# Altium project B108AA.PrjPcb (part 1 of 4)
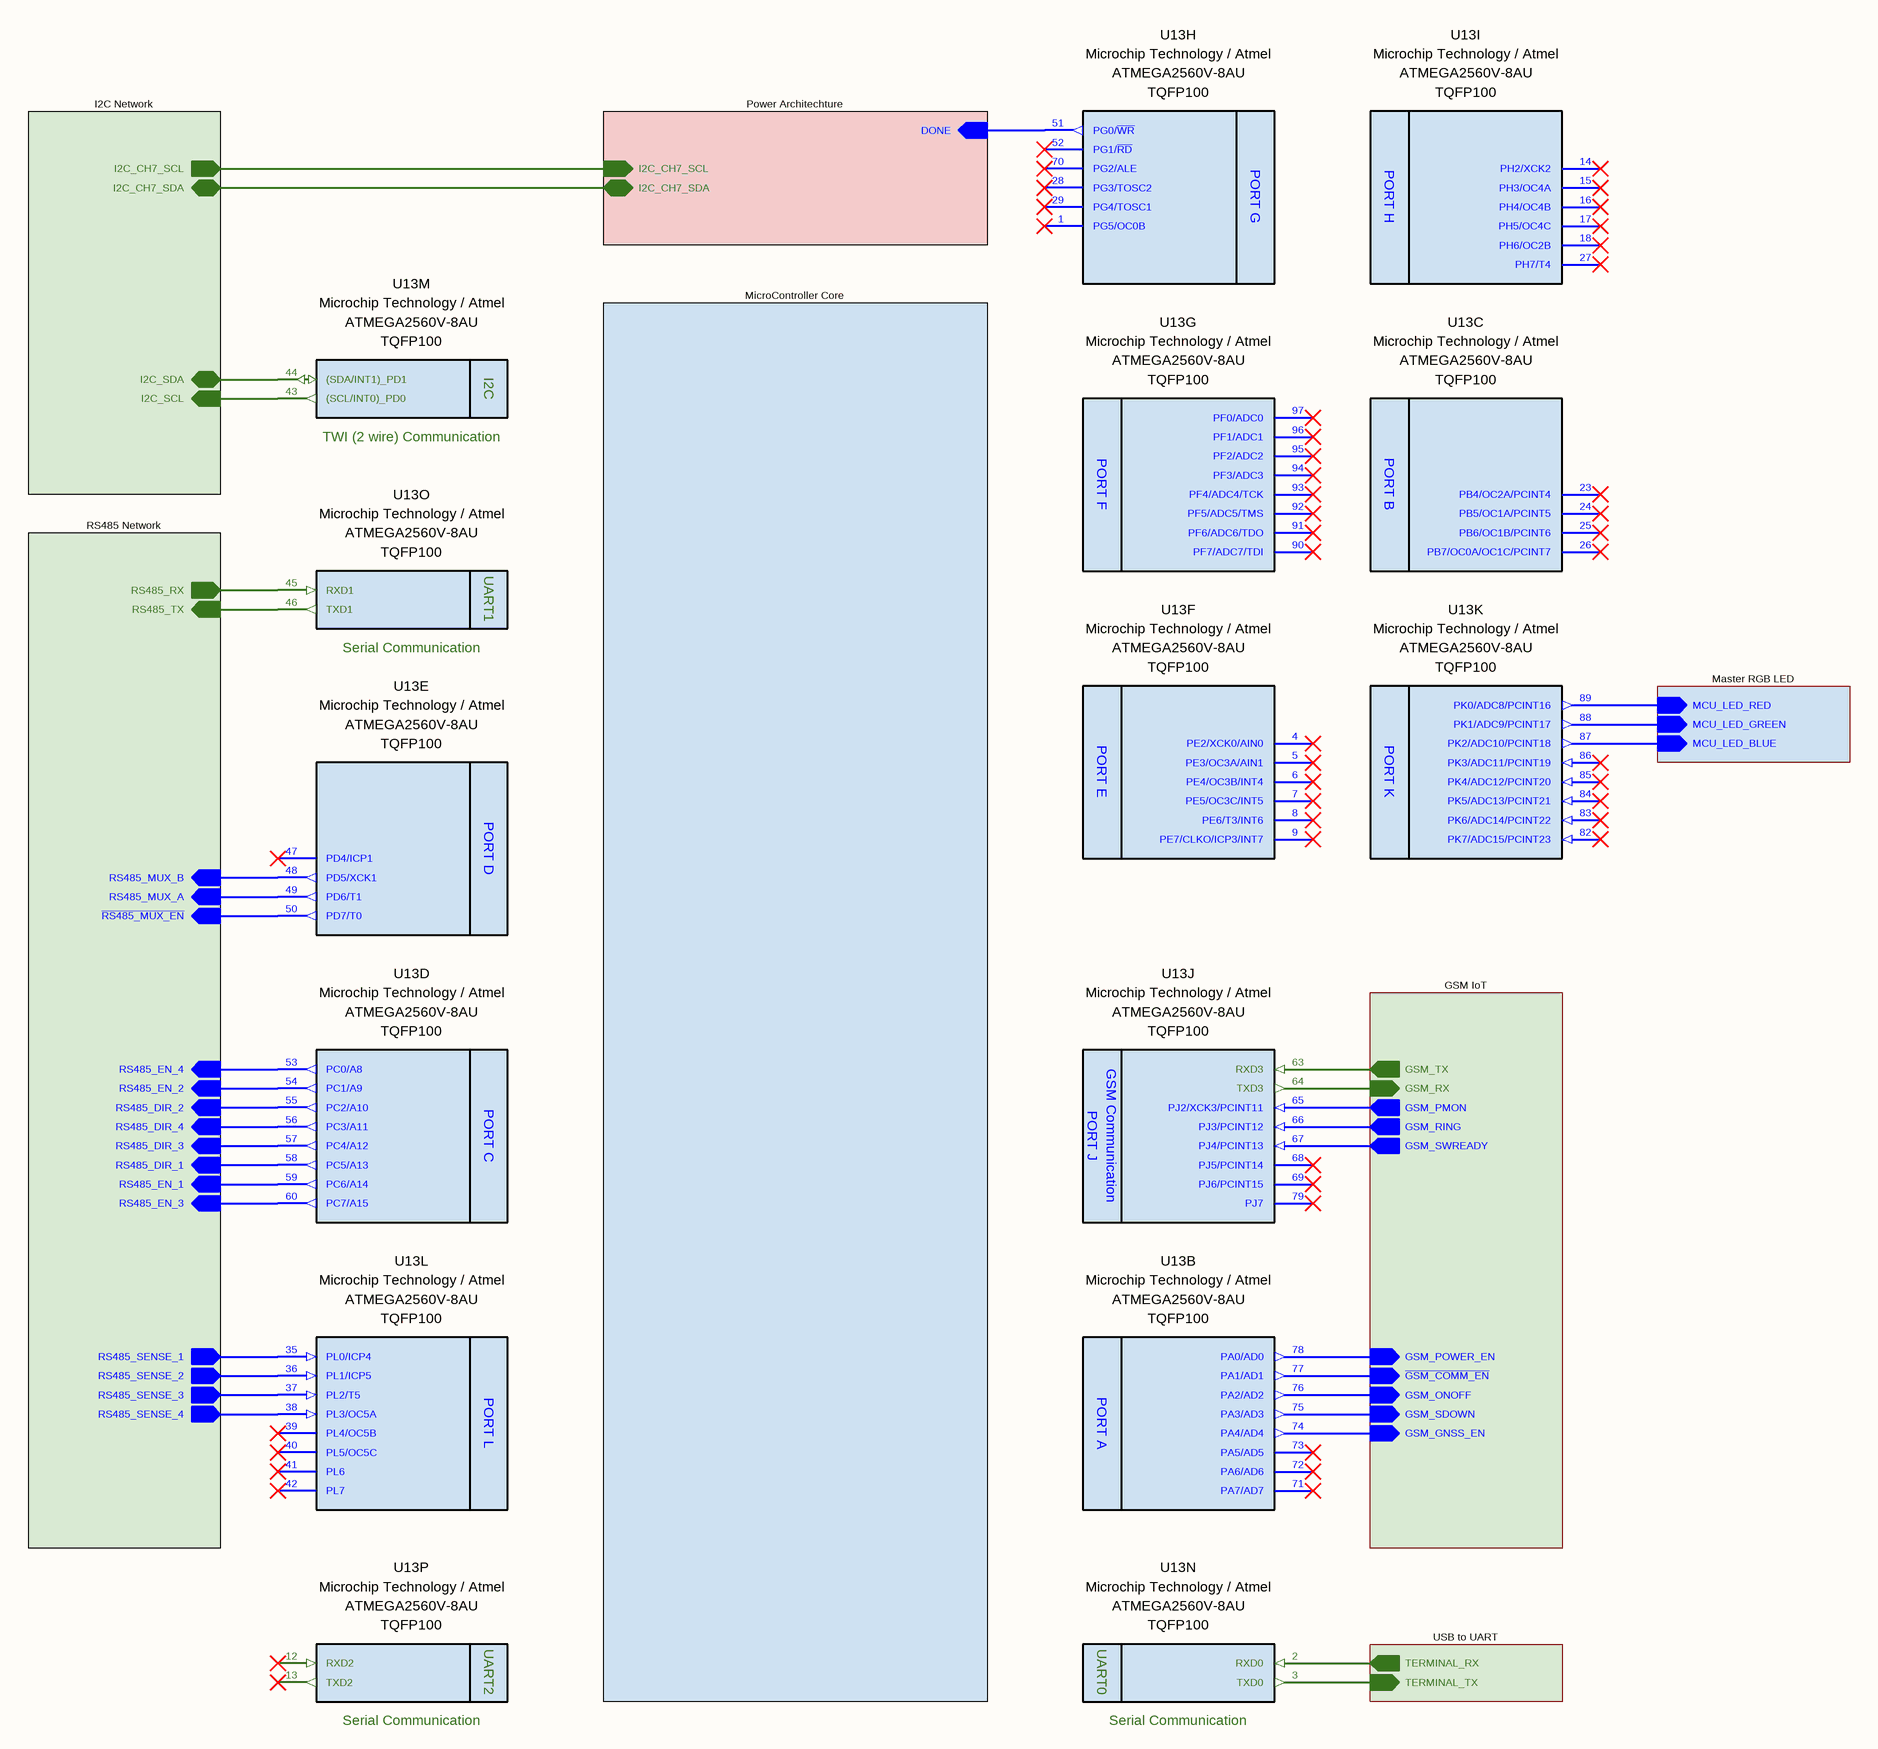
[diagram p0: Block Diagram.SchDoc]
Address1_: 4. O.S.B. Büyük Kayacık Mh.; Address2_: 103. Cd. No:12; Address3_: Selcuklu / Konya; Address4_: Türkiye; Copyright_: Copyright 2023 Mehmet Gunce Akkoyun (Commercial Secret); Customer_: STF Labs; Engineer_: Gunce Akkoyun; Git_Repo_Address_: www.github.com/akkoyun/B108AA; Module_ID_: B108AA; Organization_: STF Irrigation; Product_Desc_: WeatherStat V4; Product_ID_: -; Revision_: 01.00.00; Version_: R1
40 sheets, 315 parts. Net scope: hierarchical (ports join the sheet entries above them; power ports are global).
Board file: B108AA.PcbDoc
Sheets:
  Block Diagram.SchDoc
    RS485 Network = RS485 Outputs.SchDoc
      RS485 Channel 1 = RS485 Channel 1.SchDoc
      RS485 Channel 2 = RS485 Channel 2.SchDoc
      RS485 Channel 3 = RS485 Channel 3.SchDoc
      RS485 Channel 4 = RS485 Channel 4.SchDoc
      RS485 UART Multiplexer = RS485 UART Multiplexer.SchDoc
    I2C Network = I2C Network.SchDoc
      I2C Multiplexer = I2C Multiplexer.SchDoc
      I2C DP Sensor 1 = I2C DP Sensor 1.SchDoc
      I2C DP Sensor 2 = I2C DP Sensor 2.SchDoc
      I2C DP Sensor 3 = I2C DP Sensor 3.SchDoc
      I2C Air Pressure Sensor = I2C Air Pressure Sensor.SchDoc
      I2C TH Sensor = I2C TH Sensor Socket.SchDoc
      I2C UV Sensor = I2C UV Sensor.SchDoc
      I2C Serial ID = I2C Serial ID.SchDoc
    Power Architechture = Power Architechture.SchDoc
      Battery & Battery Measurement = Power Battery Measurement.SchDoc
      Battery Charger = Power Battery Charger.SchDoc
      5V Boost Converter = Power 5V Boost Converter.SchDoc
      3V3 LDO Regulator = Power 3V3 Regulator.SchDoc
      Sleep Timer = Power Sleep Timer.SchDoc
    GSM IoT = GSM IoT Block Diagram.SchDoc
      Signal Translator = GSM Voltage Translator.SchDoc
      GSM Antenna Match = GSM Modem Antenna.SchDoc
      Connection Status LED Driver = GSM Status LED Driver.SchDoc
      SIM Socket = GSM SIM Socket.SchDoc
      Power Source = GSM Power Source.SchDoc
      GSM UnUsed Pins = GSM UnUsed.SchDoc
      GNSS Antenna Match = GNSS Antenna.SchDoc
      GNSS PPS LED Driver = GSM PPS LED Driver.SchDoc
      Signal Control = GSM Signal Block Diagram.SchDoc
        On-Off Control = GSM On-Off Signal Control.SchDoc
        SDown Control = GSM Shut Down Signal Control.SchDoc
        GNSS Enable Control = GSM GNSS En Signal Control.SchDoc
      Power LED Driver = GSM Power LED Driver.SchDoc
      GSM USB Connection = GSM USB Port.SchDoc
    MicroController Core = MicroController Core.SchDoc
    USB to UART = MicroController USB to UART Converter.SchDoc
    Master RGB LED = MicroController RGB LED.SchDoc

## Sheet Block Diagram.SchDoc: Block Diagram
size 393 x 292 mm; SheetNumber: 1; SheetTotal: 40

### Parts
U13  Manufacturer Name: Microchip Technology / Atmel  Case: TQFP100  [TQFP-100]  (hidden comment: ATMEGA2560V-8AU)  (parts B,C,D,E,F,G,H,I,J,K,L,M,N,O,P of 18)

### Sub-sheets
GSM IoT = GSM IoT Block Diagram.SchDoc: GSM_ONOFF (in), GSM_SDOWN (in), GSM_GNSS_EN (in), GSM_PMON (out), GSM_SWREADY (out), GSM_RING (out), ~{GSM_COMM_EN} (in), GSM_TX (out), GSM_RX (in), GSM_POWER_EN (in)
I2C Network = I2C Network.SchDoc: I2C_CH7_SDA (bidir), I2C_CH7_SCL (out), I2C_SDA (bidir), I2C_SCL (in)
Master RGB LED = MicroController RGB LED.SchDoc: MCU_LED_RED (in), MCU_LED_GREEN (in), MCU_LED_BLUE (in)
MicroController Core = MicroController Core.SchDoc: no entries
Power Architechture = Power Architechture.SchDoc: DONE (in), I2C_CH7_SDA (bidir), I2C_CH7_SCL (in)
RS485 Network = RS485 Outputs.SchDoc: RS485_EN_1 (in), RS485_SENSE_1 (out), RS485_DIR_1 (in), RS485_EN_2 (in), RS485_SENSE_2 (out), RS485_DIR_2 (in), RS485_EN_3 (in), RS485_SENSE_3 (out), RS485_DIR_3 (in), RS485_EN_4 (in), RS485_SENSE_4 (out), RS485_DIR_4 (in), ~{RS485_MUX_EN} (in), RS485_MUX_A (in), RS485_MUX_B (in), RS485_TX (in), RS485_RX (out)
USB to UART = MicroController USB to UART Converter.SchDoc: TERMINAL_TX (in), TERMINAL_RX (out)

### Nets
DONE: U13.51(PG0/~{WR}) ; sheet Power Architechture/DONE
~{GSM_COMM_EN}: U13.77(PA1/AD1) ; sheet GSM IoT/~{GSM_COMM_EN}
GSM_GNSS_EN: U13.74(PA4/AD4) ; sheet GSM IoT/GSM_GNSS_EN
GSM_ONOFF: U13.76(PA2/AD2) ; sheet GSM IoT/GSM_ONOFF
GSM_PMON: U13.65(PJ2/XCK3/PCINT11) ; sheet GSM IoT/GSM_PMON
GSM_POWER_EN: U13.78(PA0/AD0) ; sheet GSM IoT/GSM_POWER_EN
GSM_RING: U13.66(PJ3/PCINT12) ; sheet GSM IoT/GSM_RING
GSM_RX: U13.64(TXD3) ; sheet GSM IoT/GSM_RX
GSM_SDOWN: U13.75(PA3/AD3) ; sheet GSM IoT/GSM_SDOWN
GSM_SWREADY: U13.67(PJ4/PCINT13) ; sheet GSM IoT/GSM_SWREADY
GSM_TX: U13.63(RXD3) ; sheet GSM IoT/GSM_TX
I2C_CH7_SCL: sheet I2C Network/I2C_CH7_SCL, sheet Power Architechture/I2C_CH7_SCL
I2C_CH7_SDA: sheet I2C Network/I2C_CH7_SDA, sheet Power Architechture/I2C_CH7_SDA
I2C_SCL: U13.43((SCL/INT0)_PD0) ; sheet I2C Network/I2C_SCL
I2C_SDA: U13.44((SDA/INT1)_PD1) ; sheet I2C Network/I2C_SDA
MCU_LED_BLUE: U13.87(PK2/ADC10/PCINT18) ; sheet Master RGB LED/MCU_LED_BLUE
MCU_LED_GREEN: U13.88(PK1/ADC9/PCINT17) ; sheet Master RGB LED/MCU_LED_GREEN
MCU_LED_RED: U13.89(PK0/ADC8/PCINT16) ; sheet Master RGB LED/MCU_LED_RED
~{RS485_MUX_EN}: U13.50(PD7/T0) ; sheet RS485 Network/~{RS485_MUX_EN}
RS485_DIR_1: U13.58(PC5/A13) ; sheet RS485 Network/RS485_DIR_1
RS485_DIR_2: U13.55(PC2/A10) ; sheet RS485 Network/RS485_DIR_2
RS485_DIR_3: U13.57(PC4/A12) ; sheet RS485 Network/RS485_DIR_3
RS485_DIR_4: U13.56(PC3/A11) ; sheet RS485 Network/RS485_DIR_4
RS485_EN_1: U13.59(PC6/A14) ; sheet RS485 Network/RS485_EN_1
RS485_EN_2: U13.54(PC1/A9) ; sheet RS485 Network/RS485_EN_2
RS485_EN_3: U13.60(PC7/A15) ; sheet RS485 Network/RS485_EN_3
RS485_EN_4: U13.53(PC0/A8) ; sheet RS485 Network/RS485_EN_4
RS485_MUX_A: U13.49(PD6/T1) ; sheet RS485 Network/RS485_MUX_A
RS485_MUX_B: U13.48(PD5/XCK1) ; sheet RS485 Network/RS485_MUX_B
RS485_RX: U13.45(RXD1) ; sheet RS485 Network/RS485_RX
RS485_SENSE_1: U13.35(PL0/ICP4) ; sheet RS485 Network/RS485_SENSE_1
RS485_SENSE_2: U13.36(PL1/ICP5) ; sheet RS485 Network/RS485_SENSE_2
RS485_SENSE_3: U13.37(PL2/T5) ; sheet RS485 Network/RS485_SENSE_3
RS485_SENSE_4: U13.38(PL3/OC5A) ; sheet RS485 Network/RS485_SENSE_4
RS485_TX: U13.46(TXD1) ; sheet RS485 Network/RS485_TX
NetU13_2: U13.2(RXD0) ; sheet USB to UART/TERMINAL_RX
NetU13_3: U13.3(TXD0) ; sheet USB to UART/TERMINAL_TX

Not connected (* = marked no-connect by the designer): U13 1(PG5/OC0B)* 4(PE2/XCK0/AIN0)* 5(PE3/OC3A/AIN1)* 6(PE4/OC3B/INT4)* 7(PE5/OC3C/INT5)* 8(PE6/T3/INT6)* 9(PE7/CLKO/ICP3/INT7)* 12(RXD2)* 13(TXD2)* 14(PH2/XCK2)* 15(PH3/OC4A)* 16(PH4/OC4B)* 17(PH5/OC4C)* 18(PH6/OC2B)* 23(PB4/OC2A/PCINT4)* 24(PB5/OC1A/PCINT5)* 25(PB6/OC1B/PCINT6)* 26(PB7/OC0A/OC1C/PCINT7)* 27(PH7/T4)* 28(PG3/TOSC2)* 29(PG4/TOSC1)* 39(PL4/OC5B)* 40(PL5/OC5C)* 41(PL6)* 42(PL7)* 47(PD4/ICP1)* 52(PG1/~{RD})* 68(PJ5/PCINT14)* 69(PJ6/PCINT15)* 70(PG2/ALE)* 71(PA7/AD7)* 72(PA6/AD6)* 73(PA5/AD5)* 79(PJ7)* 82(PK7/ADC15/PCINT23)* 83(PK6/ADC14/PCINT22)* 84(PK5/ADC13/PCINT21)* 85(PK4/ADC12/PCINT20)* 86(PK3/ADC11/PCINT19)* 90(PF7/ADC7/TDI)* 91(PF6/ADC6/TDO)* 92(PF5/ADC5/TMS)* 93(PF4/ADC4/TCK)* 94(PF3/ADC3)* 95(PF2/ADC2)* 96(PF1/ADC1)* 97(PF0/ADC0)*

### Notes on the sheet
- © 2022 All rights reserved.
  This document may not, in whole or in part, be copied, photocopied, reproduced, translated or converted to any electronic or machine readable from without prior written permission of Mehmet Günce Akkoyun.
  Engineer contact : akkoyun@me.com
- Property of
- Engineer :
- Date :
- Size :
- A3
- Time :
- Project :
- Page :
- /
- Customer :
- Product ID :
- Module ID :
- Version :
- File :
- Revision :
- (in symbol IC - AtMega2560V-8AU, part B) PORT A
- (in symbol IC - AtMega2560V-8AU, part C) PORT B
- (in symbol IC - AtMega2560V-8AU, part D) PORT C
- (in symbol IC - AtMega2560V-8AU, part E) PORT D
- (in symbol IC - AtMega2560V-8AU, part F) PORT E
- (in symbol IC - AtMega2560V-8AU, part G) PORT F
- (in symbol IC - AtMega2560V-8AU, part H) PORT G
- (in symbol IC - AtMega2560V-8AU, part I) PORT H
- (in symbol IC - AtMega2560V-8AU, part J) PORT J; GSM Communication
- (in symbol IC - AtMega2560V-8AU, part K) PORT K
- (in symbol IC - AtMega2560V-8AU, part L) PORT L
- (in symbol IC - AtMega2560V-8AU, part M) I2C; TWI (2 wire) Communication
- (in symbol IC - AtMega2560V-8AU, part N) UART0; Serial Communication
- (in symbol IC - AtMega2560V-8AU, part O) UART1; Serial Communication
- (in symbol IC - AtMega2560V-8AU, part P) UART2; Serial Communication

### Library data of the parts
U13 = IC - AtMega2560V-8AU: ATmega Series 256 KB Flash 8 KB SRAM 8 MHz 8-Bit Microcontroller - TQFP-100; Program Memory Size: 256 kB; Core: AVR; Operating Supply Voltage: 2.7 V to 5.5 V; Maximum Clock Frequency: 8 MHz; Maximum Operating Temperature: + 85 C; Product Type: MicroControllers; Minimum Operating Temperature: - 40 C; Manufacturer Part Number: ATMEGA2560V-8AU

## Sheet RS485 Outputs.SchDoc: RS485 Outputs
size 292 x 193 mm; SheetNumber: 17; SheetTotal: 38
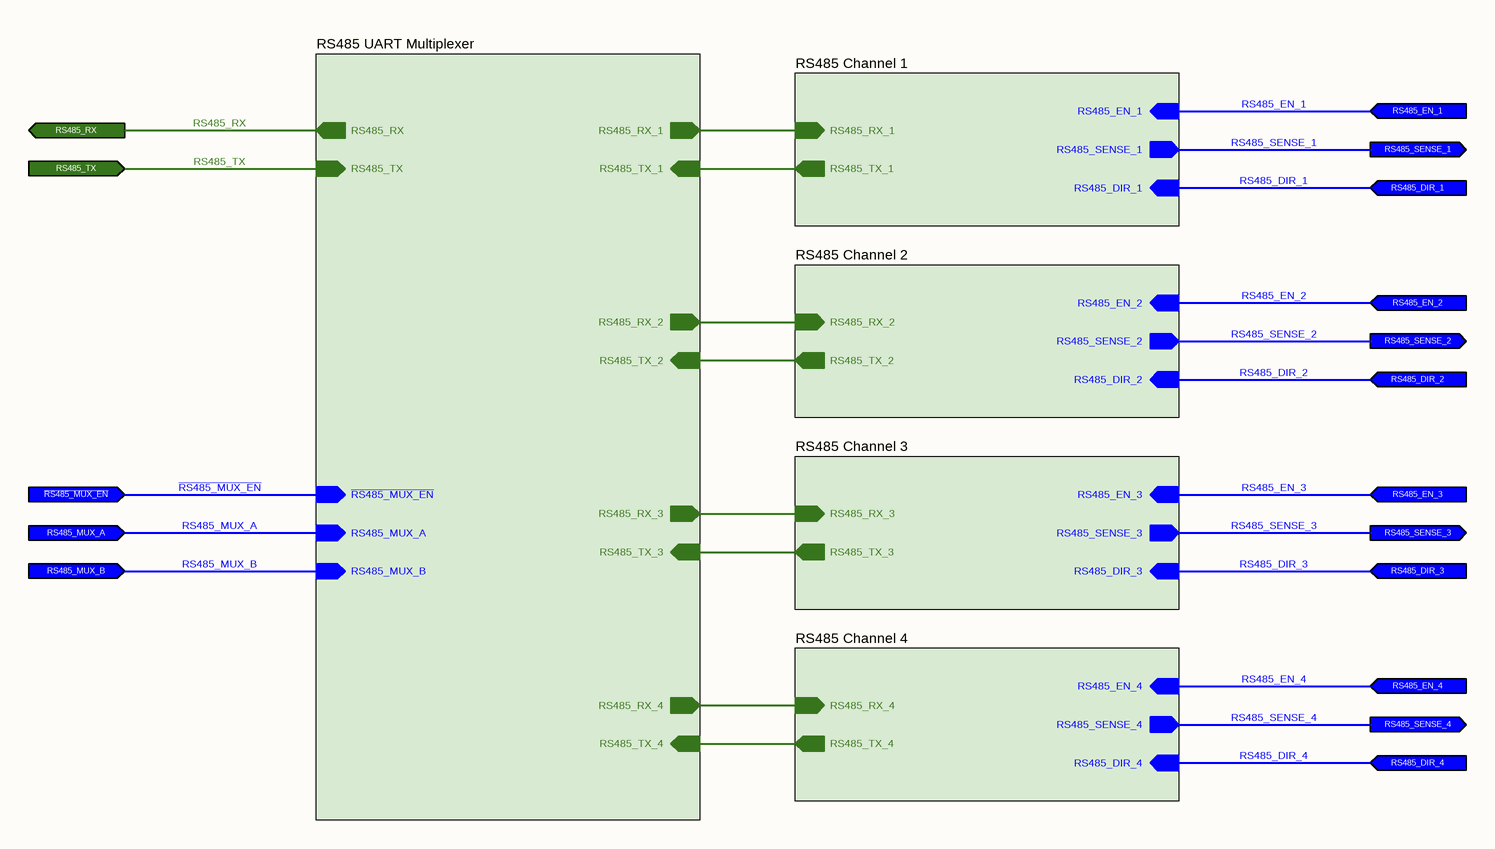
[diagram p1: RS485 Outputs.SchDoc]

### Sub-sheets
RS485 Channel 1 = RS485 Channel 1.SchDoc: RS485_TX_1 (out), RS485_RX_1 (in), RS485_EN_1 (in), RS485_SENSE_1 (out), RS485_DIR_1 (in)
RS485 Channel 2 = RS485 Channel 2.SchDoc: RS485_TX_2 (out), RS485_RX_2 (in), RS485_EN_2 (in), RS485_SENSE_2 (out), RS485_DIR_2 (in)
RS485 Channel 3 = RS485 Channel 3.SchDoc: RS485_TX_3 (out), RS485_RX_3 (in), RS485_EN_3 (in), RS485_SENSE_3 (out), RS485_DIR_3 (in)
RS485 Channel 4 = RS485 Channel 4.SchDoc: RS485_TX_4 (out), RS485_RX_4 (in), RS485_EN_4 (in), RS485_SENSE_4 (out), RS485_DIR_4 (in)
RS485 UART Multiplexer = RS485 UART Multiplexer.SchDoc: RS485_TX_1 (in), RS485_TX_3 (in), RS485_RX_2 (out), RS485_MUX_A (in), RS485_TX_2 (in), RS485_MUX_B (in), RS485_RX_1 (out), ~{RS485_MUX_EN} (in), RS485_TX (in), RS485_RX_3 (out), RS485_RX (out), RS485_RX_4 (out), RS485_TX_4 (in)

### Ports
RS485_DIR_1 (in), RS485_DIR_2 (in), RS485_DIR_3 (in), RS485_DIR_4 (in), RS485_EN_1 (in), RS485_EN_2 (in), RS485_EN_3 (in), RS485_EN_4 (in), RS485_MUX_A (in), RS485_MUX_B (in), RS485_RX (out), RS485_SENSE_1 (out), RS485_SENSE_2 (out), RS485_SENSE_3 (out), RS485_SENSE_4 (out), RS485_TX (in), ~{RS485_MUX_EN} (in)

### Nets
~{RS485_MUX_EN}: port ~{RS485_MUX_EN}, sheet RS485 UART Multiplexer/~{RS485_MUX_EN}
RS485_DIR_1: port RS485_DIR_1, sheet RS485 Channel 1/RS485_DIR_1
RS485_DIR_2: port RS485_DIR_2, sheet RS485 Channel 2/RS485_DIR_2
RS485_DIR_3: port RS485_DIR_3, sheet RS485 Channel 3/RS485_DIR_3
RS485_DIR_4: port RS485_DIR_4, sheet RS485 Channel 4/RS485_DIR_4
RS485_EN_1: port RS485_EN_1, sheet RS485 Channel 1/RS485_EN_1
RS485_EN_2: port RS485_EN_2, sheet RS485 Channel 2/RS485_EN_2
RS485_EN_3: port RS485_EN_3, sheet RS485 Channel 3/RS485_EN_3
RS485_EN_4: port RS485_EN_4, sheet RS485 Channel 4/RS485_EN_4
RS485_MUX_A: port RS485_MUX_A, sheet RS485 UART Multiplexer/RS485_MUX_A
RS485_MUX_B: port RS485_MUX_B, sheet RS485 UART Multiplexer/RS485_MUX_B
RS485_RX: port RS485_RX, sheet RS485 UART Multiplexer/RS485_RX
RS485_RX_1: sheet RS485 Channel 1/RS485_RX_1, sheet RS485 UART Multiplexer/RS485_RX_1
RS485_RX_2: sheet RS485 Channel 2/RS485_RX_2, sheet RS485 UART Multiplexer/RS485_RX_2
RS485_RX_3: sheet RS485 Channel 3/RS485_RX_3, sheet RS485 UART Multiplexer/RS485_RX_3
RS485_RX_4: sheet RS485 Channel 4/RS485_RX_4, sheet RS485 UART Multiplexer/RS485_RX_4
RS485_SENSE_1: port RS485_SENSE_1, sheet RS485 Channel 1/RS485_SENSE_1
RS485_SENSE_2: port RS485_SENSE_2, sheet RS485 Channel 2/RS485_SENSE_2
RS485_SENSE_3: port RS485_SENSE_3, sheet RS485 Channel 3/RS485_SENSE_3
RS485_SENSE_4: port RS485_SENSE_4, sheet RS485 Channel 4/RS485_SENSE_4
RS485_TX: port RS485_TX, sheet RS485 UART Multiplexer/RS485_TX
RS485_TX_1: sheet RS485 Channel 1/RS485_TX_1, sheet RS485 UART Multiplexer/RS485_TX_1
RS485_TX_2: sheet RS485 Channel 2/RS485_TX_2, sheet RS485 UART Multiplexer/RS485_TX_2
RS485_TX_3: sheet RS485 Channel 3/RS485_TX_3, sheet RS485 UART Multiplexer/RS485_TX_3
RS485_TX_4: sheet RS485 Channel 4/RS485_TX_4, sheet RS485 UART Multiplexer/RS485_TX_4

### Notes on the sheet
- © 2021 All rights reserved.
  This document may not, in whole or in part, be copied, photocopied, reproduced, translated or converted to any electronic or machine readable from without prior written permission of Mehmet Günce Akkoyun.
  Engineer contact : akkoyun@me.com
- Property of
- Engineer :
- Date :
- Size :
- A4
- Time :
- Project :
- Page :
- /
- Customer :
- Product ID :
- Module ID :
- Version :
- File :
- Revision :

## Sheet RS485 Channel 1.SchDoc: RS485 Channel-1
size 292 x 193 mm; SheetNumber: 19; SheetTotal: 40
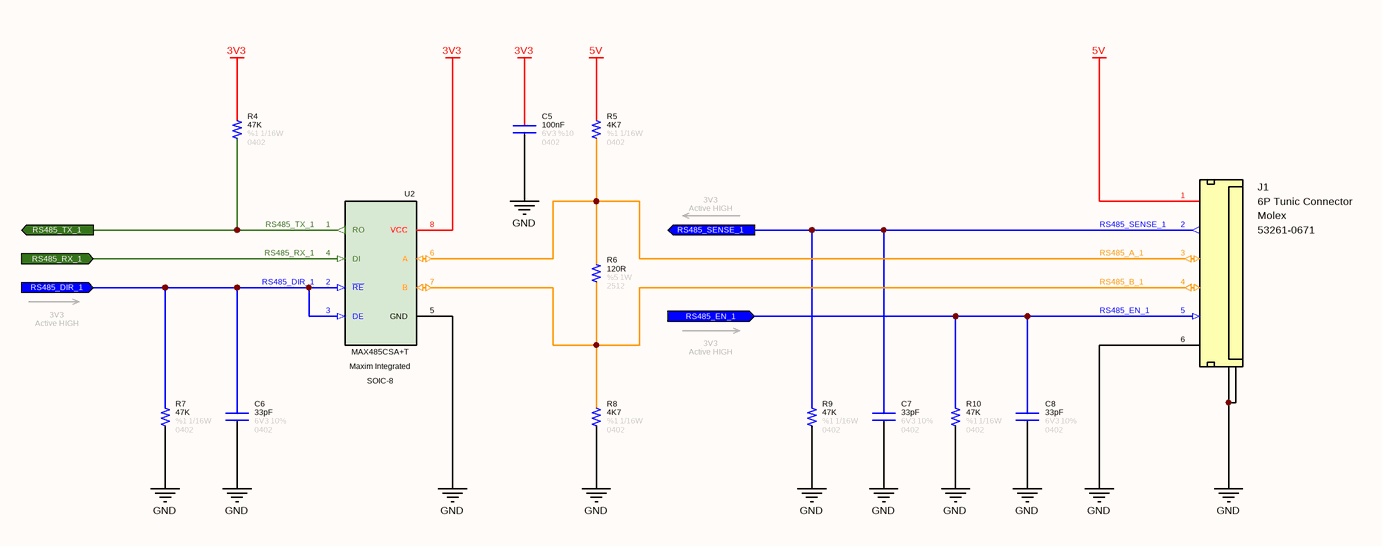
[diagram p2: RS485 Channel 1.SchDoc]

### Parts
C5  value 100nF  Tolerance: %10  Voltage: 6V3  Case: 0402  [CAPACITOR_0402]  (hidden comment: Capacitor - 100nF [0402] (Ceramic))
C6  value 33pF  Tolerance: 10%  Case: 0402  Voltage: 6V3  [CAPACITOR_0402]  (hidden comment: Capacitor - 33pF [0402] (Ceramic))
C7  value 33pF  Tolerance: 10%  Case: 0402  Voltage: 6V3  [CAPACITOR_0402]  (hidden comment: Capacitor - 33pF [0402] (Ceramic))
C8  value 33pF  Tolerance: 10%  Case: 0402  Voltage: 6V3  [CAPACITOR_0402]  (hidden comment: Capacitor - 33pF [0402] (Ceramic))
J1  6P Tunic Connector  Manufacturer Part Number: 53261-0671  Manufacturer Name: Molex  [Connector_Tunic 6P]
R4  value 47K  Tolerance: %1  Case: 0402  Power: 1/16W  [RESISTOR_0402]  (hidden comment: 47K - 0402 - %1 - 1/16W)
R5  value 4K7  Tolerance: %1  Case: 0402  Power: 1/16W  [RESISTOR_0402]  (hidden comment: 4K7 - 0402 - %1 - 1/16W)
R6  value 120R  Tolerance: %5  Case: 2512  Power: 1W  [RESISTOR_2512]  (hidden comment: 120R - 2512 - %5 - 1W)
R7  value 47K  Tolerance: %1  Case: 0402  Power: 1/16W  [RESISTOR_0402]  (hidden comment: 47K - 0402 - %1 - 1/16W)
R8  value 4K7  Tolerance: %1  Case: 0402  Power: 1/16W  [RESISTOR_0402]  (hidden comment: 4K7 - 0402 - %1 - 1/16W)
R9  value 47K  Tolerance: %1  Case: 0402  Power: 1/16W  [RESISTOR_0402]  (hidden comment: 47K - 0402 - %1 - 1/16W)
R10  value 47K  Tolerance: %1  Case: 0402  Power: 1/16W  [RESISTOR_0402]  (hidden comment: 47K - 0402 - %1 - 1/16W)
U2  Case: SOIC-8  Manufacturer Part Number: MAX485CSA+T  Manufacturer Name: Maxim Integrated  [SOP-8L (AZRS3080E)]  (hidden comment: RS485 Modulator)

### Ports
RS485_DIR_1 (in), RS485_EN_1 (in), RS485_RX_1 (in), RS485_SENSE_1 (out), RS485_TX_1 (out)

### Nets
3V3: C5.2 R4.2 U2.8(VCC)
5V: J1.1(5V) R5.2
GND: C5.1 C6.1 C7.1 C8.1 J1.6(GND) J1.7(GND) J1.8(GND) R7.1 R8.1 R9.1 R10.1 U2.5(GND)
RS485_A_1: J1.3(RS485-A) R5.1 R6.2 U2.6(A)
RS485_B_1: J1.4(RS485-B) R6.1 R8.2 U2.7(B)
RS485_DIR_1: C6.2 R7.2 U2.2(~{RE}) U2.3(DE) ; port RS485_DIR_1
RS485_EN_1: C8.2 J1.5(INT) R10.2 ; port RS485_EN_1
RS485_RX_1: U2.4(DI) ; port RS485_RX_1
RS485_SENSE_1: C7.2 J1.2(Sense) R9.2 ; port RS485_SENSE_1
RS485_TX_1: R4.1 U2.1(RO) ; port RS485_TX_1

### Notes on the sheet
- 3V3
  Active HIGH
- © 2021 All rights reserved.
  This document may not, in whole or in part, be copied, photocopied, reproduced, translated or converted to any electronic or machine readable from without prior written permission of Mehmet Günce Akkoyun.
  Engineer contact : akkoyun@me.com
- Property of
- Engineer :
- Date :
- Size :
- A4
- Time :
- Project :
- Page :
- /
- Customer :
- Product ID :
- Module ID :
- Version :
- File :
- Revision :

### Library data of the parts
C5 = Capacitor - 100nF [0402-6V3]: Capacitor - 100nF [0402-6V3] (Ceramic); Manufacturer Name: AVX; Manufacturer Part Number: 04026D104KAT4A; ComponentLink1Description: Mouser; ComponentLink1URL: https://www.mouser.com.tr/ProductDetail/AVX/04026D104KAT4A?qs=sGAEpiMZZMs0AnBnWHyRQPg4iYkCw7IMED%2F4kpqgf7w%3D; ComponentLink2Description: DataSheet; ComponentLink2URL: https://www.mouser.com.tr/datasheet/2/40/cx5r-776519.pdf
C6-C8 = Capacitor - 33pF [0402-6V3]: Manufacturer Name: Kemet; Manufacturer Part Number: C0402C330J9RACAUTO; ComponentLink1Description: DataSheet; ComponentLink1URL: https://api.kemet.com/component-edge/download/datasheet/C0402C330J9RACAUTO.pdf; ComponentLink2Description: Mouser; ComponentLink2URL: https://www.mouser.com/Search/Refine.aspx?Keyword=80-C0402C330J9RAUTO
J1 = Connector - Mini Tunic 6P (1.25): Mini Tunic Connector with 6P; ROHS: Yes; System: Connector
R4 R7 R9 R10 = Resistor - 47K [0402]: Thick Film Resistors - SMD 1/16 W 47 KOhm 1%; Manufacturer Name: Vishay; Manufacturer Part Number: CRCW040247K0FKED; ComponentLink1Description: DataSheet; ComponentLink1URL: https://www.mouser.com.tr/datasheet/2/427/dcrcwe3-1762152.pdf; ComponentLink2Description: Mouser; ComponentLink2URL: https://www.mouser.com.tr/ProductDetail/Vishay-Dale/CRCW040247K0FKED?qs=sGAEpiMZZMu61qfTUdNhG2DpbjADlD3GL%252B3h1elTxqU%3D
R5 R8 = Resistor - 4K7 [0402]: Thick Film Resistors - SMD 1/16 W 4.7 KOhm 1%; Manufacturer Name: Vishay; Manufacturer Part Number: CRCW04024K70FKED; ComponentLink1Description: DataSheet; ComponentLink1URL: https://www.mouser.com.tr/datasheet/2/427/dcrcwe3-1762152.pdf; ComponentLink2Description: Mouser; ComponentLink2URL: https://www.mouser.com.tr/ProductDetail/Vishay-Dale/CRCW04024K70FKED?qs=sGAEpiMZZMu61qfTUdNhG7nHf%2F6MTUn3HadIdDQu24Q%3D
R6 = Resistor - 120R [2512]: Thick Film Resistors - SMD 1 W 120 Ohm 5%; Manufacturer Name: YAGEO; Manufacturer Part Number: RC2512JK-07120RL; ComponentLink1Description: DataSheet; ComponentLink1URL: https://www.mouser.com.tr/datasheet/2/447/PYu_RC_Group_51_RoHS_L_11-1984063.pdf
U2 = IC - MAX485CSA+T: RS-422/RS-485 Interface IC Low-Power, Slew-Rate-Limited RS-485/RS-422 Transceivers; RoHS: Yes

## Sheet RS485 Channel 2.SchDoc: RS485 Channel-2
size 292 x 193 mm; SheetNumber: 20; SheetTotal: 40
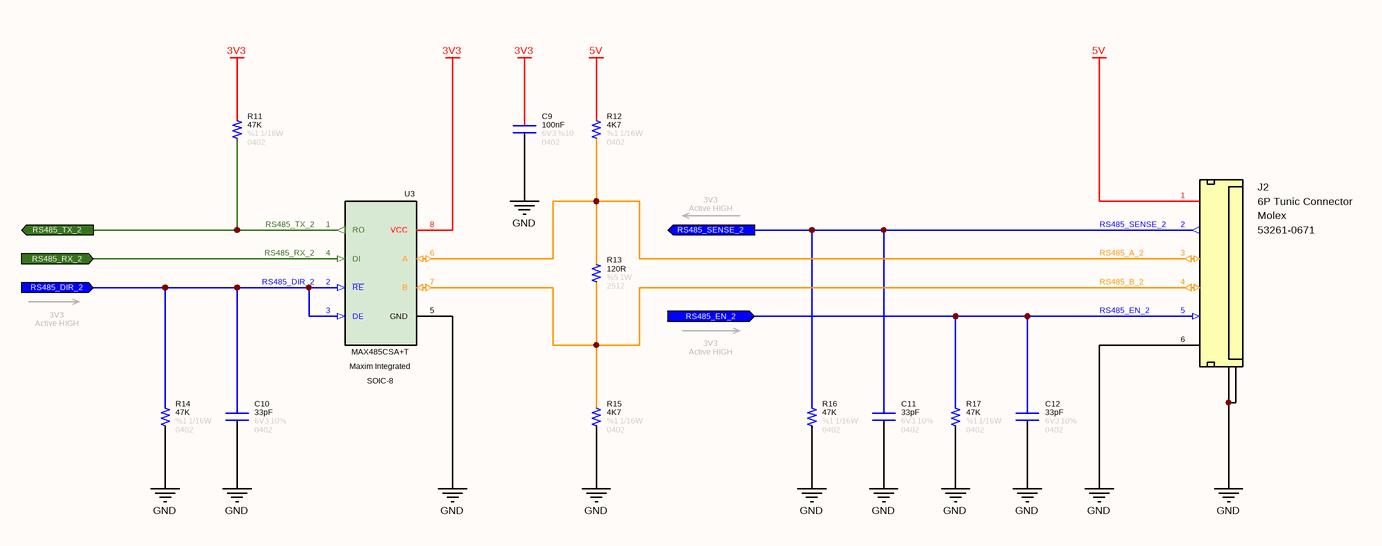
[diagram p3: RS485 Channel 2.SchDoc]

### Parts
C9  value 100nF  Tolerance: %10  Voltage: 6V3  Case: 0402  [CAPACITOR_0402]  (hidden comment: Capacitor - 100nF [0402] (Ceramic))
C10  value 33pF  Tolerance: 10%  Case: 0402  Voltage: 6V3  [CAPACITOR_0402]  (hidden comment: Capacitor - 33pF [0402] (Ceramic))
C11  value 33pF  Tolerance: 10%  Case: 0402  Voltage: 6V3  [CAPACITOR_0402]  (hidden comment: Capacitor - 33pF [0402] (Ceramic))
C12  value 33pF  Tolerance: 10%  Case: 0402  Voltage: 6V3  [CAPACITOR_0402]  (hidden comment: Capacitor - 33pF [0402] (Ceramic))
J2  6P Tunic Connector  Manufacturer Part Number: 53261-0671  Manufacturer Name: Molex  [Connector_Tunic 6P]
R11  value 47K  Tolerance: %1  Case: 0402  Power: 1/16W  [RESISTOR_0402]  (hidden comment: 47K - 0402 - %1 - 1/16W)
R12  value 4K7  Tolerance: %1  Case: 0402  Power: 1/16W  [RESISTOR_0402]  (hidden comment: 4K7 - 0402 - %1 - 1/16W)
R13  value 120R  Tolerance: %5  Case: 2512  Power: 1W  [RESISTOR_2512]  (hidden comment: 120R - 2512 - %5 - 1W)
R14  value 47K  Tolerance: %1  Case: 0402  Power: 1/16W  [RESISTOR_0402]  (hidden comment: 47K - 0402 - %1 - 1/16W)
R15  value 4K7  Tolerance: %1  Case: 0402  Power: 1/16W  [RESISTOR_0402]  (hidden comment: 4K7 - 0402 - %1 - 1/16W)
R16  value 47K  Tolerance: %1  Case: 0402  Power: 1/16W  [RESISTOR_0402]  (hidden comment: 47K - 0402 - %1 - 1/16W)
R17  value 47K  Tolerance: %1  Case: 0402  Power: 1/16W  [RESISTOR_0402]  (hidden comment: 47K - 0402 - %1 - 1/16W)
U3  Case: SOIC-8  Manufacturer Part Number: MAX485CSA+T  Manufacturer Name: Maxim Integrated  [SOP-8L (AZRS3080E)]  (hidden comment: RS485 Modulator)

### Ports
RS485_DIR_2 (in), RS485_EN_2 (in), RS485_RX_2 (in), RS485_SENSE_2 (out), RS485_TX_2 (out)

### Nets
3V3: C9.2 R11.2 U3.8(VCC)
5V: J2.1(5V) R12.2
GND: C9.1 C10.1 C11.1 C12.1 J2.6(GND) J2.7(GND) J2.8(GND) R14.1 R15.1 R16.1 R17.1 U3.5(GND)
RS485_A_2: J2.3(RS485-A) R12.1 R13.2 U3.6(A)
RS485_B_2: J2.4(RS485-B) R13.1 R15.2 U3.7(B)
RS485_DIR_2: C10.2 R14.2 U3.2(~{RE}) U3.3(DE) ; port RS485_DIR_2
RS485_EN_2: C12.2 J2.5(INT) R17.2 ; port RS485_EN_2
RS485_RX_2: U3.4(DI) ; port RS485_RX_2
RS485_SENSE_2: C11.2 J2.2(Sense) R16.2 ; port RS485_SENSE_2
RS485_TX_2: R11.1 U3.1(RO) ; port RS485_TX_2

### Notes on the sheet
- 3V3
  Active HIGH
- © 2021 All rights reserved.
  This document may not, in whole or in part, be copied, photocopied, reproduced, translated or converted to any electronic or machine readable from without prior written permission of Mehmet Günce Akkoyun.
  Engineer contact : akkoyun@me.com
- Property of
- Engineer :
- Date :
- Size :
- A4
- Time :
- Project :
- Page :
- /
- Customer :
- Product ID :
- Module ID :
- Version :
- File :
- Revision :

### Library data of the parts
C9 = Capacitor - 100nF [0402-6V3]: as C5 on sheet RS485 Channel 1; ComponentLink1Description: Mouser; ComponentLink1URL: https://www.mouser.com.tr/ProductDetail/AVX/04026D104KAT4A?qs=sGAEpiMZZMs0AnBnWHyRQPg4iYkCw7IMED%2F4kpqgf7w%3D; ComponentLink2Description: DataSheet; ComponentLink2URL: https://www.mouser.com.tr/datasheet/2/40/cx5r-776519.pdf
C10-C12 = Capacitor - 33pF [0402-6V3]: as C6 on sheet RS485 Channel 1; ComponentLink1Description: DataSheet; ComponentLink1URL: https://api.kemet.com/component-edge/download/datasheet/C0402C330J9RACAUTO.pdf; ComponentLink2Description: Mouser; ComponentLink2URL: https://www.mouser.com/Search/Refine.aspx?Keyword=80-C0402C330J9RAUTO
J2 = Connector - Mini Tunic 6P (1.25): Mini Tunic Connector with 6P; ROHS: Yes; System: Connector
R11 R14 R16 R17 = Resistor - 47K [0402]: as R4 on sheet RS485 Channel 1; ComponentLink1Description: DataSheet; ComponentLink1URL: https://www.mouser.com.tr/datasheet/2/427/dcrcwe3-1762152.pdf; ComponentLink2Description: Mouser; ComponentLink2URL: https://www.mouser.com.tr/ProductDetail/Vishay-Dale/CRCW040247K0FKED?qs=sGAEpiMZZMu61qfTUdNhG2DpbjADlD3GL%252B3h1elTxqU%3D
R12 R15 = Resistor - 4K7 [0402]: as R5 on sheet RS485 Channel 1; ComponentLink1Description: DataSheet; ComponentLink1URL: https://www.mouser.com.tr/datasheet/2/427/dcrcwe3-1762152.pdf; ComponentLink2Description: Mouser; ComponentLink2URL: https://www.mouser.com.tr/ProductDetail/Vishay-Dale/CRCW04024K70FKED?qs=sGAEpiMZZMu61qfTUdNhG7nHf%2F6MTUn3HadIdDQu24Q%3D
R13 = Resistor - 120R [2512]: as R6 on sheet RS485 Channel 1; ComponentLink1Description: DataSheet; ComponentLink1URL: https://www.mouser.com.tr/datasheet/2/447/PYu_RC_Group_51_RoHS_L_11-1984063.pdf
U3 = IC - MAX485CSA+T: as U2 on sheet RS485 Channel 1; RoHS: Yes

## Sheet RS485 Channel 3.SchDoc: RS485 Channel-1
size 292 x 193 mm; SheetNumber: 21; SheetTotal: 40
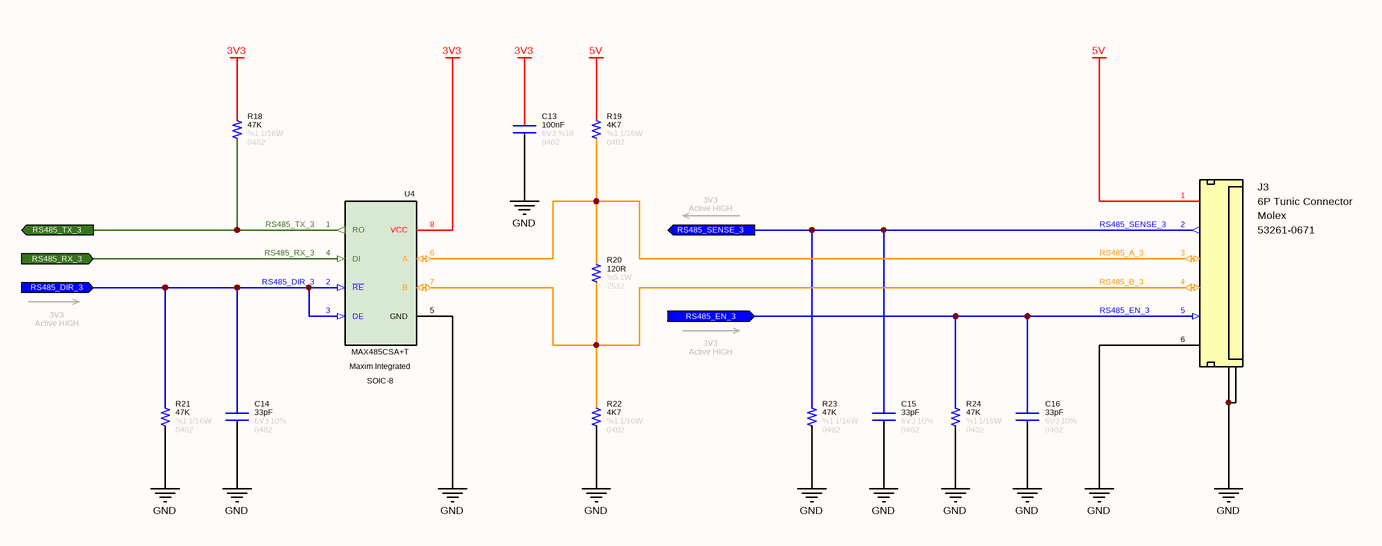
[diagram p4: RS485 Channel 3.SchDoc]

### Parts
C13  value 100nF  Tolerance: %10  Voltage: 6V3  Case: 0402  [CAPACITOR_0402]  (hidden comment: Capacitor - 100nF [0402] (Ceramic))
C14  value 33pF  Tolerance: 10%  Case: 0402  Voltage: 6V3  [CAPACITOR_0402]  (hidden comment: Capacitor - 33pF [0402] (Ceramic))
C15  value 33pF  Tolerance: 10%  Case: 0402  Voltage: 6V3  [CAPACITOR_0402]  (hidden comment: Capacitor - 33pF [0402] (Ceramic))
C16  value 33pF  Tolerance: 10%  Case: 0402  Voltage: 6V3  [CAPACITOR_0402]  (hidden comment: Capacitor - 33pF [0402] (Ceramic))
J3  6P Tunic Connector  Manufacturer Part Number: 53261-0671  Manufacturer Name: Molex  [Connector_Tunic 6P]
R18  value 47K  Tolerance: %1  Case: 0402  Power: 1/16W  [RESISTOR_0402]  (hidden comment: 47K - 0402 - %1 - 1/16W)
R19  value 4K7  Tolerance: %1  Case: 0402  Power: 1/16W  [RESISTOR_0402]  (hidden comment: 4K7 - 0402 - %1 - 1/16W)
R20  value 120R  Tolerance: %5  Case: 2512  Power: 1W  [RESISTOR_2512]  (hidden comment: 120R - 2512 - %5 - 1W)
R21  value 47K  Tolerance: %1  Case: 0402  Power: 1/16W  [RESISTOR_0402]  (hidden comment: 47K - 0402 - %1 - 1/16W)
R22  value 4K7  Tolerance: %1  Case: 0402  Power: 1/16W  [RESISTOR_0402]  (hidden comment: 4K7 - 0402 - %1 - 1/16W)
R23  value 47K  Tolerance: %1  Case: 0402  Power: 1/16W  [RESISTOR_0402]  (hidden comment: 47K - 0402 - %1 - 1/16W)
R24  value 47K  Tolerance: %1  Case: 0402  Power: 1/16W  [RESISTOR_0402]  (hidden comment: 47K - 0402 - %1 - 1/16W)
U4  Case: SOIC-8  Manufacturer Part Number: MAX485CSA+T  Manufacturer Name: Maxim Integrated  [SOP-8L (AZRS3080E)]  (hidden comment: RS485 Modulator)

### Ports
RS485_DIR_3 (in), RS485_EN_3 (in), RS485_RX_3 (in), RS485_SENSE_3 (out), RS485_TX_3 (out)

### Nets
3V3: C13.2 R18.2 U4.8(VCC)
5V: J3.1(5V) R19.2
GND: C13.1 C14.1 C15.1 C16.1 J3.6(GND) J3.7(GND) J3.8(GND) R21.1 R22.1 R23.1 R24.1 U4.5(GND)
RS485_A_3: J3.3(RS485-A) R19.1 R20.2 U4.6(A)
RS485_B_3: J3.4(RS485-B) R20.1 R22.2 U4.7(B)
RS485_DIR_3: C14.2 R21.2 U4.2(~{RE}) U4.3(DE) ; port RS485_DIR_3
RS485_EN_3: C16.2 J3.5(INT) R24.2 ; port RS485_EN_3
RS485_RX_3: U4.4(DI) ; port RS485_RX_3
RS485_SENSE_3: C15.2 J3.2(Sense) R23.2 ; port RS485_SENSE_3
RS485_TX_3: R18.1 U4.1(RO) ; port RS485_TX_3

### Notes on the sheet
- 3V3
  Active HIGH
- © 2021 All rights reserved.
  This document may not, in whole or in part, be copied, photocopied, reproduced, translated or converted to any electronic or machine readable from without prior written permission of Mehmet Günce Akkoyun.
  Engineer contact : akkoyun@me.com
- Property of
- Engineer :
- Date :
- Size :
- A4
- Time :
- Project :
- Page :
- /
- Customer :
- Product ID :
- Module ID :
- Version :
- File :
- Revision :

### Library data of the parts
C13 = Capacitor - 100nF [0402-6V3]: as C5 on sheet RS485 Channel 1; ComponentLink1Description: Mouser; ComponentLink1URL: https://www.mouser.com.tr/ProductDetail/AVX/04026D104KAT4A?qs=sGAEpiMZZMs0AnBnWHyRQPg4iYkCw7IMED%2F4kpqgf7w%3D; ComponentLink2Description: DataSheet; ComponentLink2URL: https://www.mouser.com.tr/datasheet/2/40/cx5r-776519.pdf
C14-C16 = Capacitor - 33pF [0402-6V3]: as C6 on sheet RS485 Channel 1; ComponentLink1Description: DataSheet; ComponentLink1URL: https://api.kemet.com/component-edge/download/datasheet/C0402C330J9RACAUTO.pdf; ComponentLink2Description: Mouser; ComponentLink2URL: https://www.mouser.com/Search/Refine.aspx?Keyword=80-C0402C330J9RAUTO
J3 = Connector - Mini Tunic 6P (1.25): Mini Tunic Connector with 6P; ROHS: Yes
R18 R21 R23 R24 = Resistor - 47K [0402]: as R4 on sheet RS485 Channel 1; ComponentLink1Description: DataSheet; ComponentLink1URL: https://www.mouser.com.tr/datasheet/2/427/dcrcwe3-1762152.pdf; ComponentLink2Description: Mouser; ComponentLink2URL: https://www.mouser.com.tr/ProductDetail/Vishay-Dale/CRCW040247K0FKED?qs=sGAEpiMZZMu61qfTUdNhG2DpbjADlD3GL%252B3h1elTxqU%3D
R19 R22 = Resistor - 4K7 [0402]: as R5 on sheet RS485 Channel 1; ComponentLink1Description: DataSheet; ComponentLink1URL: https://www.mouser.com.tr/datasheet/2/427/dcrcwe3-1762152.pdf; ComponentLink2Description: Mouser; ComponentLink2URL: https://www.mouser.com.tr/ProductDetail/Vishay-Dale/CRCW04024K70FKED?qs=sGAEpiMZZMu61qfTUdNhG7nHf%2F6MTUn3HadIdDQu24Q%3D
R20 = Resistor - 120R [2512]: as R6 on sheet RS485 Channel 1; ComponentLink1Description: DataSheet; ComponentLink1URL: https://www.mouser.com.tr/datasheet/2/447/PYu_RC_Group_51_RoHS_L_11-1984063.pdf
U4 = IC - MAX485CSA+T: as U2 on sheet RS485 Channel 1; RoHS: Yes

## Sheet RS485 Channel 4.SchDoc: RS485 Channel-1
size 292 x 193 mm; SheetNumber: 22; SheetTotal: 40
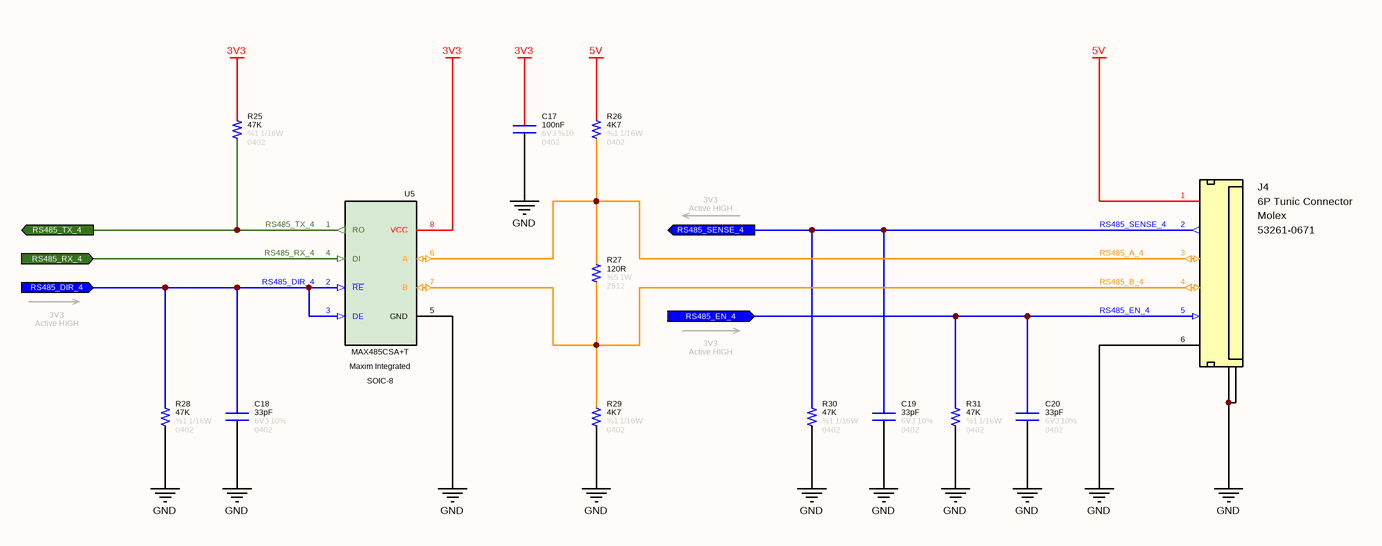
[diagram p5: RS485 Channel 4.SchDoc]

### Parts
C17  value 100nF  Tolerance: %10  Voltage: 6V3  Case: 0402  [CAPACITOR_0402]  (hidden comment: Capacitor - 100nF [0402] (Ceramic))
C18  value 33pF  Tolerance: 10%  Case: 0402  Voltage: 6V3  [CAPACITOR_0402]  (hidden comment: Capacitor - 33pF [0402] (Ceramic))
C19  value 33pF  Tolerance: 10%  Case: 0402  Voltage: 6V3  [CAPACITOR_0402]  (hidden comment: Capacitor - 33pF [0402] (Ceramic))
C20  value 33pF  Tolerance: 10%  Case: 0402  Voltage: 6V3  [CAPACITOR_0402]  (hidden comment: Capacitor - 33pF [0402] (Ceramic))
J4  6P Tunic Connector  Manufacturer Part Number: 53261-0671  Manufacturer Name: Molex  [Connector_Tunic 6P]
R25  value 47K  Tolerance: %1  Case: 0402  Power: 1/16W  [RESISTOR_0402]  (hidden comment: 47K - 0402 - %1 - 1/16W)
R26  value 4K7  Tolerance: %1  Case: 0402  Power: 1/16W  [RESISTOR_0402]  (hidden comment: 4K7 - 0402 - %1 - 1/16W)
R27  value 120R  Tolerance: %5  Case: 2512  Power: 1W  [RESISTOR_2512]  (hidden comment: 120R - 2512 - %5 - 1W)
R28  value 47K  Tolerance: %1  Case: 0402  Power: 1/16W  [RESISTOR_0402]  (hidden comment: 47K - 0402 - %1 - 1/16W)
R29  value 4K7  Tolerance: %1  Case: 0402  Power: 1/16W  [RESISTOR_0402]  (hidden comment: 4K7 - 0402 - %1 - 1/16W)
R30  value 47K  Tolerance: %1  Case: 0402  Power: 1/16W  [RESISTOR_0402]  (hidden comment: 47K - 0402 - %1 - 1/16W)
R31  value 47K  Tolerance: %1  Case: 0402  Power: 1/16W  [RESISTOR_0402]  (hidden comment: 47K - 0402 - %1 - 1/16W)
U5  Case: SOIC-8  Manufacturer Part Number: MAX485CSA+T  Manufacturer Name: Maxim Integrated  [SOP-8L (AZRS3080E)]  (hidden comment: RS485 Modulator)

### Ports
RS485_DIR_4 (in), RS485_EN_4 (in), RS485_RX_4 (in), RS485_SENSE_4 (out), RS485_TX_4 (out)

### Nets
3V3: C17.2 R25.2 U5.8(VCC)
5V: J4.1(5V) R26.2
GND: C17.1 C18.1 C19.1 C20.1 J4.6(GND) J4.7(GND) J4.8(GND) R28.1 R29.1 R30.1 R31.1 U5.5(GND)
RS485_A_4: J4.3(RS485-A) R26.1 R27.2 U5.6(A)
RS485_B_4: J4.4(RS485-B) R27.1 R29.2 U5.7(B)
RS485_DIR_4: C18.2 R28.2 U5.2(~{RE}) U5.3(DE) ; port RS485_DIR_4
RS485_EN_4: C20.2 J4.5(INT) R31.2 ; port RS485_EN_4
RS485_RX_4: U5.4(DI) ; port RS485_RX_4
RS485_SENSE_4: C19.2 J4.2(Sense) R30.2 ; port RS485_SENSE_4
RS485_TX_4: R25.1 U5.1(RO) ; port RS485_TX_4

### Notes on the sheet
- 3V3
  Active HIGH
- © 2021 All rights reserved.
  This document may not, in whole or in part, be copied, photocopied, reproduced, translated or converted to any electronic or machine readable from without prior written permission of Mehmet Günce Akkoyun.
  Engineer contact : akkoyun@me.com
- Property of
- Engineer :
- Date :
- Size :
- A4
- Time :
- Project :
- Page :
- /
- Customer :
- Product ID :
- Module ID :
- Version :
- File :
- Revision :

### Library data of the parts
C17 = Capacitor - 100nF [0402-6V3]: as C5 on sheet RS485 Channel 1; ComponentLink1Description: Mouser; ComponentLink1URL: https://www.mouser.com.tr/ProductDetail/AVX/04026D104KAT4A?qs=sGAEpiMZZMs0AnBnWHyRQPg4iYkCw7IMED%2F4kpqgf7w%3D; ComponentLink2Description: DataSheet; ComponentLink2URL: https://www.mouser.com.tr/datasheet/2/40/cx5r-776519.pdf
C18-C20 = Capacitor - 33pF [0402-6V3]: as C6 on sheet RS485 Channel 1; ComponentLink1Description: DataSheet; ComponentLink1URL: https://api.kemet.com/component-edge/download/datasheet/C0402C330J9RACAUTO.pdf; ComponentLink2Description: Mouser; ComponentLink2URL: https://www.mouser.com/Search/Refine.aspx?Keyword=80-C0402C330J9RAUTO
J4 = Connector - Mini Tunic 6P (1.25): Mini Tunic Connector with 6P; ROHS: Yes
R25 R28 R30 R31 = Resistor - 47K [0402]: as R4 on sheet RS485 Channel 1; ComponentLink1Description: DataSheet; ComponentLink1URL: https://www.mouser.com.tr/datasheet/2/427/dcrcwe3-1762152.pdf; ComponentLink2Description: Mouser; ComponentLink2URL: https://www.mouser.com.tr/ProductDetail/Vishay-Dale/CRCW040247K0FKED?qs=sGAEpiMZZMu61qfTUdNhG2DpbjADlD3GL%252B3h1elTxqU%3D
R26 R29 = Resistor - 4K7 [0402]: as R5 on sheet RS485 Channel 1; ComponentLink1Description: DataSheet; ComponentLink1URL: https://www.mouser.com.tr/datasheet/2/427/dcrcwe3-1762152.pdf; ComponentLink2Description: Mouser; ComponentLink2URL: https://www.mouser.com.tr/ProductDetail/Vishay-Dale/CRCW04024K70FKED?qs=sGAEpiMZZMu61qfTUdNhG7nHf%2F6MTUn3HadIdDQu24Q%3D
R27 = Resistor - 120R [2512]: as R6 on sheet RS485 Channel 1; ComponentLink1Description: DataSheet; ComponentLink1URL: https://www.mouser.com.tr/datasheet/2/447/PYu_RC_Group_51_RoHS_L_11-1984063.pdf
U5 = IC - MAX485CSA+T: as U2 on sheet RS485 Channel 1; RoHS: Yes

## Sheet RS485 UART Multiplexer.SchDoc: RS485 UART Multiplexer
size 292 x 193 mm; SheetNumber: 18; SheetTotal: 40
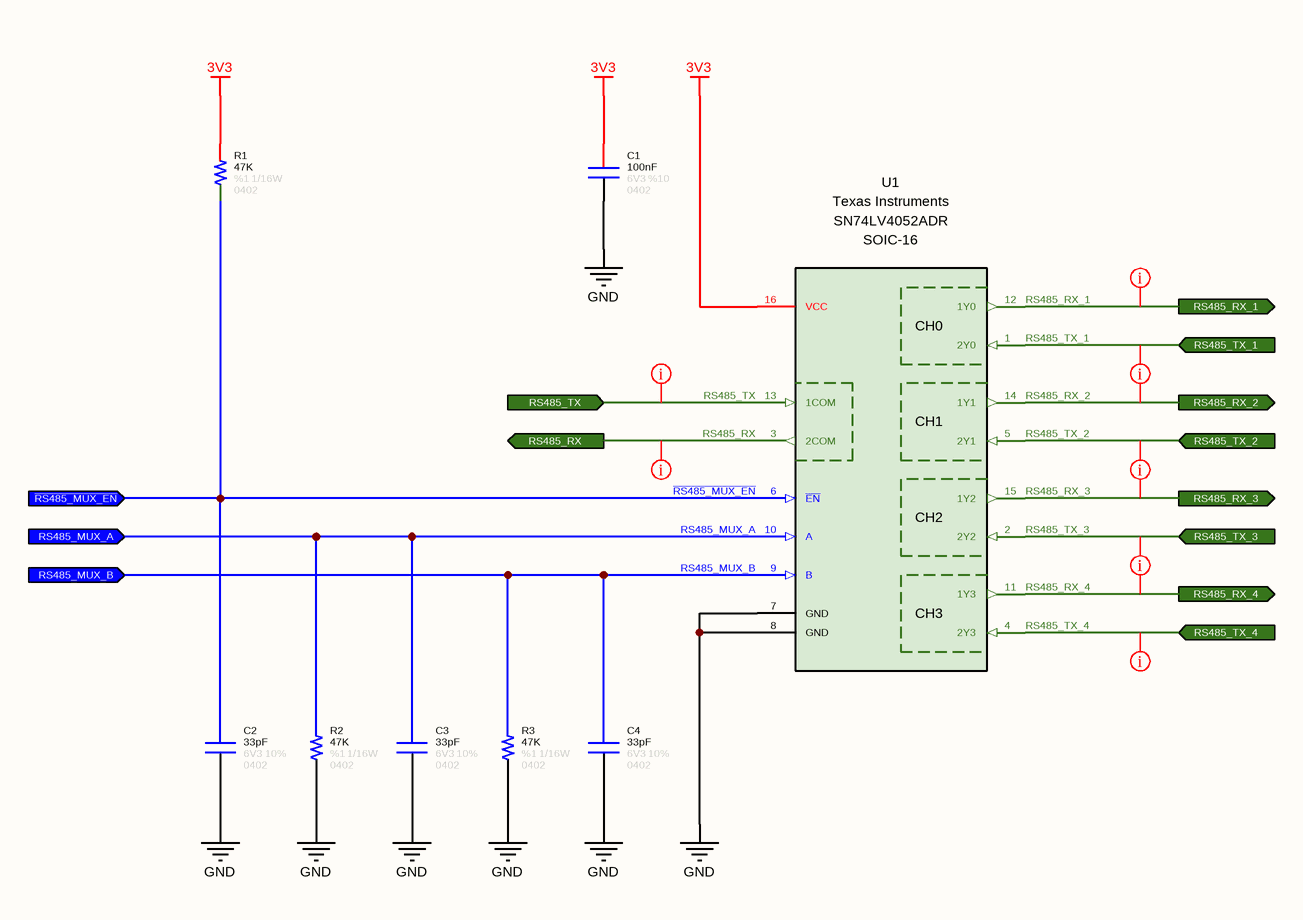
[diagram p6: RS485 UART Multiplexer.SchDoc]

### Parts
C1  value 100nF  Tolerance: %10  Voltage: 6V3  Case: 0402  [CAPACITOR_0402]  (hidden comment: Capacitor - 100nF [0402] (Ceramic))
C2  value 33pF  Tolerance: 10%  Case: 0402  Voltage: 6V3  [CAPACITOR_0402]  (hidden comment: Capacitor - 33pF [0402] (Ceramic))
C3  value 33pF  Tolerance: 10%  Case: 0402  Voltage: 6V3  [CAPACITOR_0402]  (hidden comment: Capacitor - 33pF [0402] (Ceramic))
C4  value 33pF  Tolerance: 10%  Case: 0402  Voltage: 6V3  [CAPACITOR_0402]  (hidden comment: Capacitor - 33pF [0402] (Ceramic))
R1  value 47K  Tolerance: %1  Case: 0402  Power: 1/16W  [RESISTOR_0402]  (hidden comment: 47K - 0402 - %1 - 1/16W)
R2  value 47K  Tolerance: %1  Case: 0402  Power: 1/16W  [RESISTOR_0402]  (hidden comment: 47K - 0402 - %1 - 1/16W)
R3  value 47K  Tolerance: %1  Case: 0402  Power: 1/16W  [RESISTOR_0402]  (hidden comment: 47K - 0402 - %1 - 1/16W)
U1  Manufacturer Name: Texas Instruments  Case: SOIC-16  [SOIC-16 Narrow]  (hidden comment: SN74LV4052ADR)

### Ports
RS485_MUX_A (in), RS485_MUX_B (in), RS485_RX (out), RS485_RX_1 (out), RS485_RX_2 (out), RS485_RX_3 (out), RS485_RX_4 (out), RS485_TX (in), RS485_TX_1 (in), RS485_TX_2 (in), RS485_TX_3 (in), RS485_TX_4 (in), ~{RS485_MUX_EN} (in)

### Nets
3V3: C1.2 R1.2 U1.16(VCC)
GND: C1.1 C2.1 C3.1 C4.1 R2.1 R3.1 U1.7(GND) U1.8(GND)
~{RS485_MUX_EN}: C2.2 R1.1 U1.6(~{EN}) ; port ~{RS485_MUX_EN}
RS485_MUX_A: C3.2 R2.2 U1.10(A) ; port RS485_MUX_A
RS485_MUX_B: C4.2 R3.2 U1.9(B) ; port RS485_MUX_B
RS485_RX: U1.3(2COM) ; port RS485_RX
RS485_RX_1: U1.12(1Y0) ; port RS485_RX_1
RS485_RX_2: U1.14(1Y1) ; port RS485_RX_2
RS485_RX_3: U1.15(1Y2) ; port RS485_RX_3
RS485_RX_4: U1.11(1Y3) ; port RS485_RX_4
RS485_TX: U1.13(1COM) ; port RS485_TX
RS485_TX_1: U1.1(2Y0) ; port RS485_TX_1
RS485_TX_2: U1.5(2Y1) ; port RS485_TX_2
RS485_TX_3: U1.2(2Y2) ; port RS485_TX_3
RS485_TX_4: U1.4(2Y3) ; port RS485_TX_4

### Layout directives
net class UART_Communication: RS485_RX, RS485_RX_1, RS485_RX_2, RS485_RX_3, RS485_RX_4, RS485_TX, RS485_TX_1, RS485_TX_2, RS485_TX_3, RS485_TX_4

### Notes on the sheet
- © 2021 All rights reserved.
  This document may not, in whole or in part, be copied, photocopied, reproduced, translated or converted to any electronic or machine readable from without prior written permission of Mehmet Günce Akkoyun.
  Engineer contact : akkoyun@me.com
- Property of
- Engineer :
- Date :
- Size :
- A4
- Time :
- Project :
- Page :
- /
- Customer :
- Product ID :
- Module ID :
- Version :
- File :
- Revision :
- (in symbol IC - SN74LV4052ADR) CH0; CH1; CH2; CH3

### Library data of the parts
C1 = Capacitor - 100nF [0402-6V3]: as C5 on sheet RS485 Channel 1; ComponentLink1Description: Mouser; ComponentLink1URL: https://www.mouser.com.tr/ProductDetail/AVX/04026D104KAT4A?qs=sGAEpiMZZMs0AnBnWHyRQPg4iYkCw7IMED%2F4kpqgf7w%3D; ComponentLink2Description: DataSheet; ComponentLink2URL: https://www.mouser.com.tr/datasheet/2/40/cx5r-776519.pdf
C2-C4 = Capacitor - 33pF [0402-6V3]: as C6 on sheet RS485 Channel 1; ComponentLink1Description: DataSheet; ComponentLink1URL: https://api.kemet.com/component-edge/download/datasheet/C0402C330J9RACAUTO.pdf; ComponentLink2Description: Mouser; ComponentLink2URL: https://www.mouser.com/Search/Refine.aspx?Keyword=80-C0402C330J9RAUTO
R1-R3 = Resistor - 47K [0402]: as R4 on sheet RS485 Channel 1; ComponentLink1Description: DataSheet; ComponentLink1URL: https://www.mouser.com.tr/datasheet/2/427/dcrcwe3-1762152.pdf; ComponentLink2Description: Mouser; ComponentLink2URL: https://www.mouser.com.tr/ProductDetail/Vishay-Dale/CRCW040247K0FKED?qs=sGAEpiMZZMu61qfTUdNhG2DpbjADlD3GL%252B3h1elTxqU%3D
U1 = IC - SN74LV4052ADR: Multiplexer Switch ICs Dual 4-Ch Analog Mltplxr/Demltplxr; Channel: 4; Maximum Operating Temperature: + 85 C; Minimum Operating Temperature: - 40 C; Product Type: Multiplexer Switch ICs; Manufacturer Part Number: SN74LV4052ADR

## Sheet I2C Network.SchDoc: I2C Network
size 292 x 193 mm; SheetNumber: 8; SheetTotal: 40
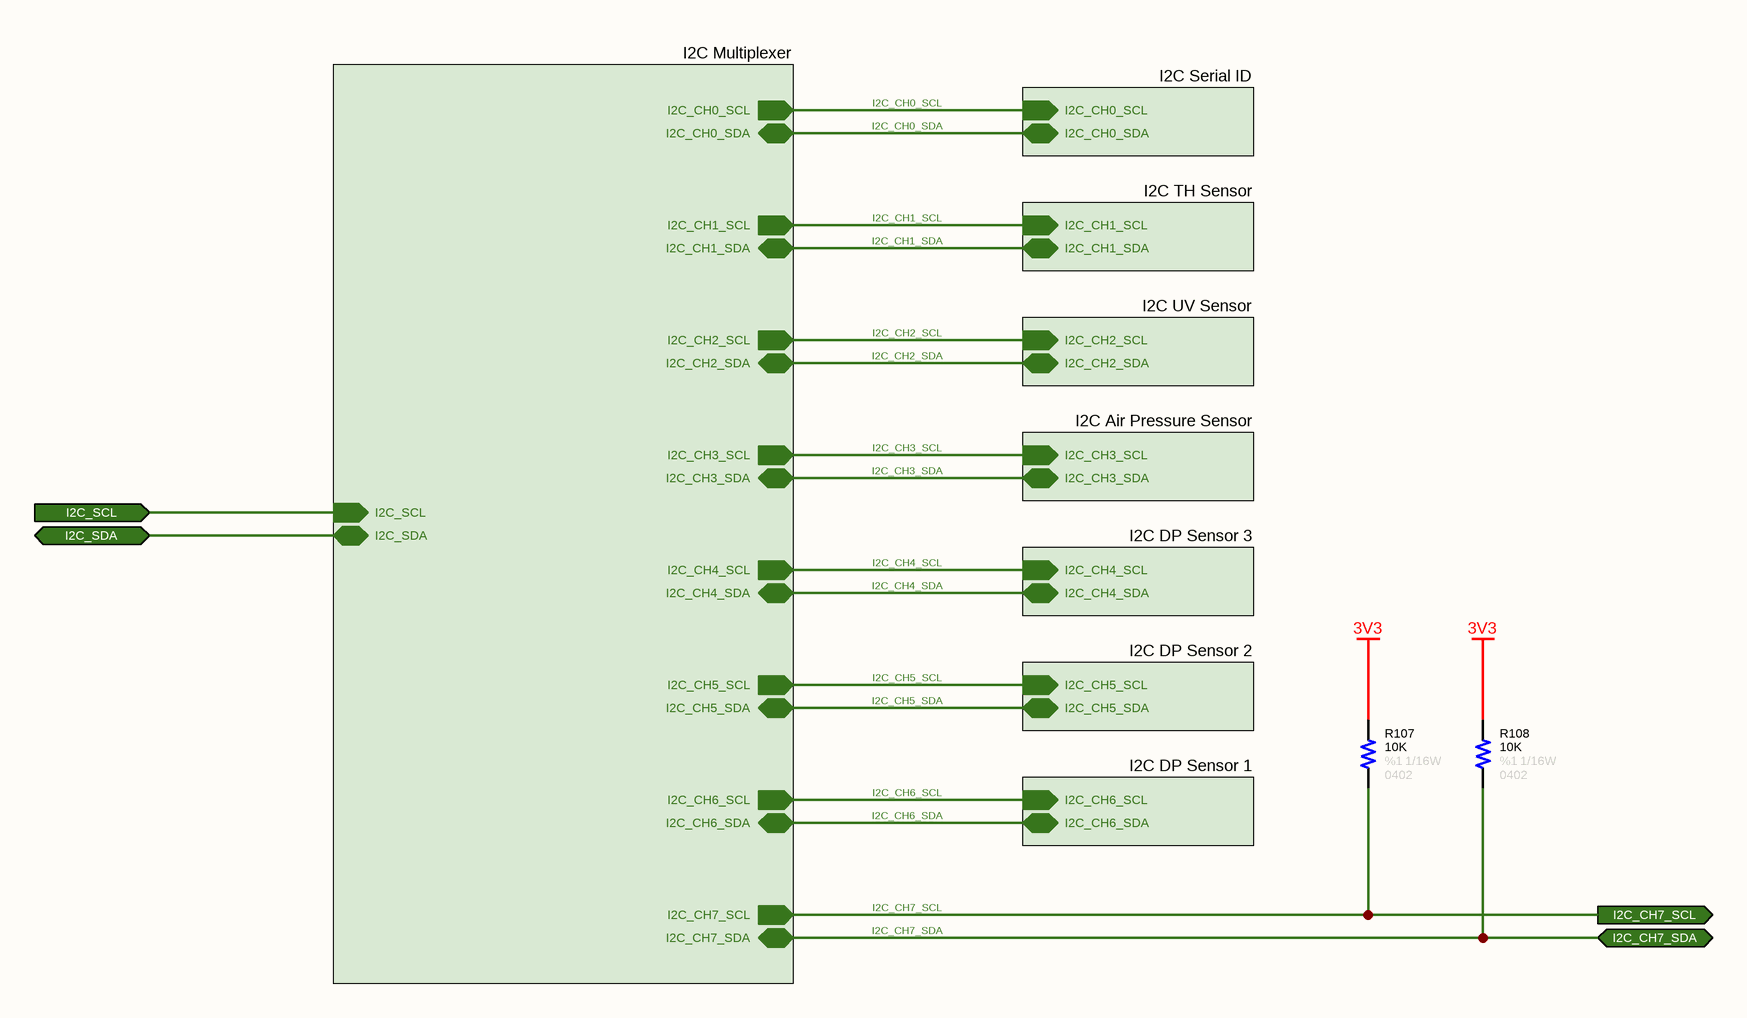
[diagram p7: I2C Network.SchDoc]

### Parts
R107  value 10K  Tolerance: %1  Case: 0402  Power: 1/16W  [RESISTOR_0402]  (hidden comment: 10K - 0402 - %1 - 1/16W)
R108  value 10K  Tolerance: %1  Case: 0402  Power: 1/16W  [RESISTOR_0402]  (hidden comment: 10K - 0402 - %1 - 1/16W)

### Sub-sheets
I2C Air Pressure Sensor = I2C Air Pressure Sensor.SchDoc: I2C_CH3_SCL (in), I2C_CH3_SDA (bidir)
I2C DP Sensor 1 = I2C DP Sensor 1.SchDoc: I2C_CH6_SCL (in), I2C_CH6_SDA (bidir)
I2C DP Sensor 2 = I2C DP Sensor 2.SchDoc: I2C_CH5_SCL (in), I2C_CH5_SDA (bidir)
I2C DP Sensor 3 = I2C DP Sensor 3.SchDoc: I2C_CH4_SCL (in), I2C_CH4_SDA (bidir)
I2C Multiplexer = I2C Multiplexer.SchDoc: I2C_CH1_SCL (out), I2C_CH0_SDA (bidir), I2C_CH1_SDA (bidir), I2C_CH0_SCL (out), I2C_CH3_SCL (out), I2C_CH4_SCL (out), I2C_CH6_SDA (bidir), I2C_CH2_SDA (bidir), I2C_SDA (bidir), I2C_CH6_SCL (out), I2C_CH5_SCL (out), I2C_CH5_SDA (bidir), I2C_CH4_SDA (bidir), I2C_CH2_SCL (out), I2C_CH3_SDA (bidir), I2C_SCL (in), I2C_CH7_SDA (bidir), I2C_CH7_SCL (out)
I2C Serial ID = I2C Serial ID.SchDoc: I2C_CH0_SCL (in), I2C_CH0_SDA (bidir)
I2C TH Sensor = I2C TH Sensor Socket.SchDoc: I2C_CH1_SCL (in), I2C_CH1_SDA (bidir)
I2C UV Sensor = I2C UV Sensor.SchDoc: I2C_CH2_SCL (in), I2C_CH2_SDA (bidir)

### Ports
I2C_CH7_SCL (out), I2C_CH7_SDA (bidir), I2C_SCL (in), I2C_SDA (bidir)

### Nets
3V3: R107.2 R108.2
I2C_CH0_SCL: sheet I2C Multiplexer/I2C_CH0_SCL, sheet I2C Serial ID/I2C_CH0_SCL
I2C_CH0_SDA: sheet I2C Multiplexer/I2C_CH0_SDA, sheet I2C Serial ID/I2C_CH0_SDA
I2C_CH1_SCL: sheet I2C Multiplexer/I2C_CH1_SCL, sheet I2C TH Sensor/I2C_CH1_SCL
I2C_CH1_SDA: sheet I2C Multiplexer/I2C_CH1_SDA, sheet I2C TH Sensor/I2C_CH1_SDA
I2C_CH2_SCL: sheet I2C Multiplexer/I2C_CH2_SCL, sheet I2C UV Sensor/I2C_CH2_SCL
I2C_CH2_SDA: sheet I2C Multiplexer/I2C_CH2_SDA, sheet I2C UV Sensor/I2C_CH2_SDA
I2C_CH3_SCL: sheet I2C Multiplexer/I2C_CH3_SCL, sheet I2C Air Pressure Sensor/I2C_CH3_SCL
I2C_CH3_SDA: sheet I2C Multiplexer/I2C_CH3_SDA, sheet I2C Air Pressure Sensor/I2C_CH3_SDA
I2C_CH4_SCL: sheet I2C Multiplexer/I2C_CH4_SCL, sheet I2C DP Sensor 3/I2C_CH4_SCL
I2C_CH4_SDA: sheet I2C Multiplexer/I2C_CH4_SDA, sheet I2C DP Sensor 3/I2C_CH4_SDA
I2C_CH5_SCL: sheet I2C Multiplexer/I2C_CH5_SCL, sheet I2C DP Sensor 2/I2C_CH5_SCL
I2C_CH5_SDA: sheet I2C Multiplexer/I2C_CH5_SDA, sheet I2C DP Sensor 2/I2C_CH5_SDA
I2C_CH6_SCL: sheet I2C Multiplexer/I2C_CH6_SCL, sheet I2C DP Sensor 1/I2C_CH6_SCL
I2C_CH6_SDA: sheet I2C Multiplexer/I2C_CH6_SDA, sheet I2C DP Sensor 1/I2C_CH6_SDA
I2C_CH7_SCL: R107.1 ; port I2C_CH7_SCL, sheet I2C Multiplexer/I2C_CH7_SCL
I2C_CH7_SDA: R108.1 ; port I2C_CH7_SDA, sheet I2C Multiplexer/I2C_CH7_SDA
I2C_SCL: port I2C_SCL, sheet I2C Multiplexer/I2C_SCL
I2C_SDA: port I2C_SDA, sheet I2C Multiplexer/I2C_SDA

### Notes on the sheet
- © 2021 All rights reserved.
  This document may not, in whole or in part, be copied, photocopied, reproduced, translated or converted to any electronic or machine readable from without prior written permission of Mehmet Günce Akkoyun.
  Engineer contact : akkoyun@me.com
- Property of
- Engineer :
- Date :
- Size :
- A4
- Time :
- Project :
- Page :
- /
- Customer :
- Product ID :
- Module ID :
- Version :
- File :
- Revision :

### Library data of the parts
R107 R108 = Resistor - 10K [0402]: Thick Film Resistors - SMD 1/16 W 10 KOhm 1%; Manufacturer Name: Vishay; Manufacturer Part Number: CRCW040210K0FKED; ComponentLink1Description: DataSheet; ComponentLink1URL: https://www.mouser.com.tr/datasheet/2/427/dcrcwe3-1762152.pdf; ComponentLink2Description: Mouser; ComponentLink2URL: https://www.mouser.com.tr/ProductDetail/Vishay-Dale/CRCW040210K0FKED?qs=sGAEpiMZZMu61qfTUdNhG2DpbjADlD3GcalbOv9utCY%3D

## Sheet I2C Multiplexer.SchDoc: I2C Multiplexer
size 292 x 193 mm; SheetNumber: 9; SheetTotal: 40
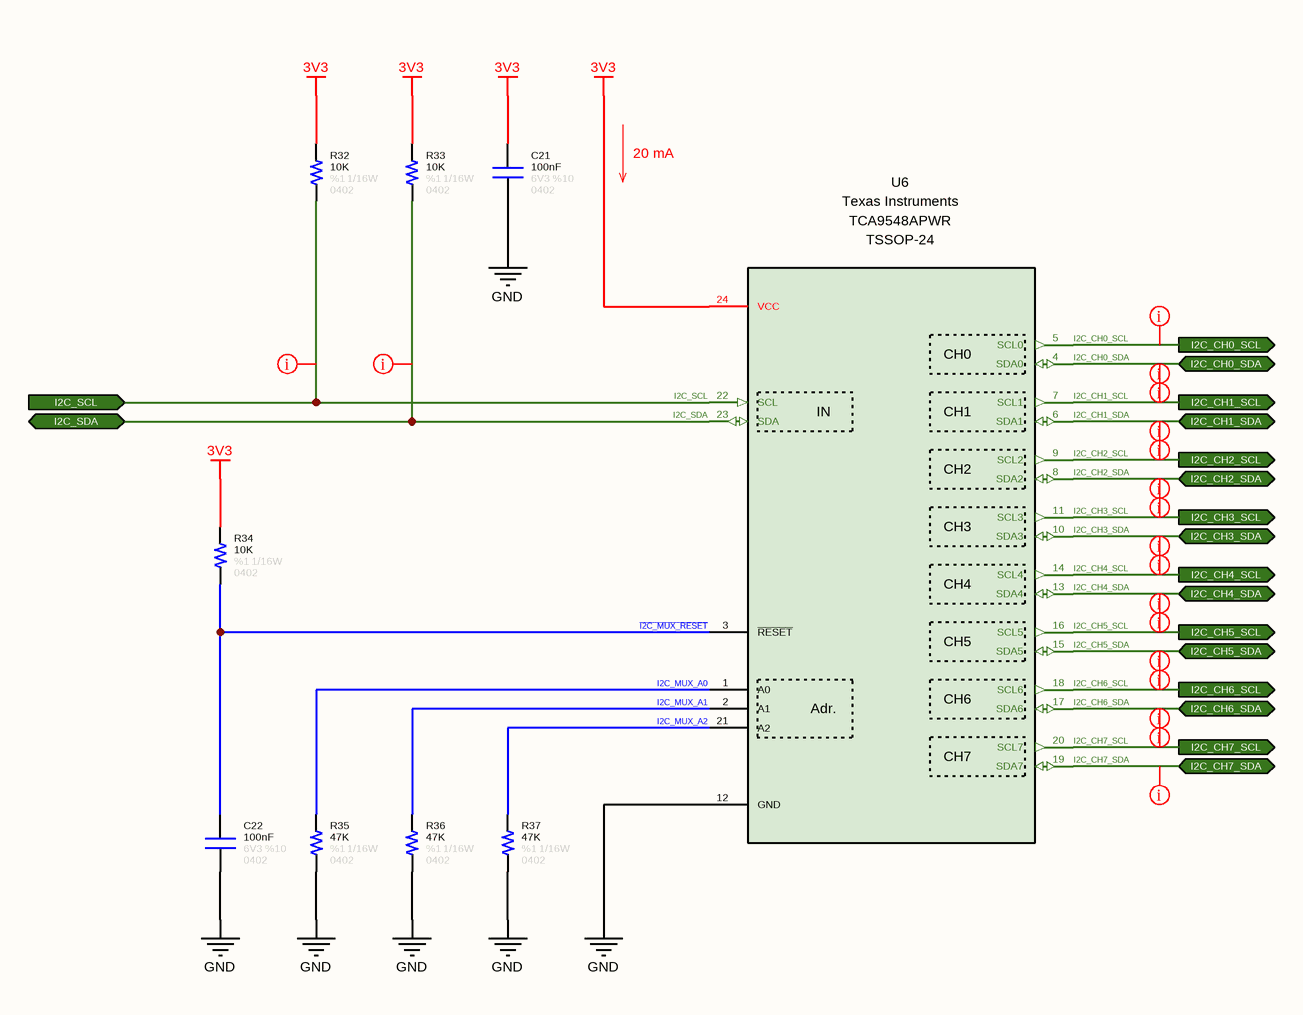
[diagram p8: I2C Multiplexer.SchDoc]

### Parts
C21  value 100nF  Tolerance: %10  Voltage: 6V3  Case: 0402  [CAPACITOR_0402]  (hidden comment: Capacitor - 100nF [0402] (Ceramic))
C22  value 100nF  Tolerance: %10  Voltage: 6V3  Case: 0402  [CAPACITOR_0402]  (hidden comment: Capacitor - 100nF [0402] (Ceramic))
R32  value 10K  Tolerance: %1  Case: 0402  Power: 1/16W  [RESISTOR_0402]  (hidden comment: 10K - 0402 - %1 - 1/16W)
R33  value 10K  Tolerance: %1  Case: 0402  Power: 1/16W  [RESISTOR_0402]  (hidden comment: 10K - 0402 - %1 - 1/16W)
R34  value 10K  Tolerance: %1  Case: 0402  Power: 1/16W  [RESISTOR_0402]  (hidden comment: 10K - 0402 - %1 - 1/16W)
R35  value 47K  Tolerance: %1  Case: 0402  Power: 1/16W  [RESISTOR_0402]  (hidden comment: 47K - 0402 - %1 - 1/16W)
R36  value 47K  Tolerance: %1  Case: 0402  Power: 1/16W  [RESISTOR_0402]  (hidden comment: 47K - 0402 - %1 - 1/16W)
R37  value 47K  Tolerance: %1  Case: 0402  Power: 1/16W  [RESISTOR_0402]  (hidden comment: 47K - 0402 - %1 - 1/16W)
U6  Manufacturer Name: Texas Instruments  [TSSOP-24]  (hidden comment: TCA9548APWR)

### Ports
I2C_CH0_SCL (out), I2C_CH0_SDA (bidir), I2C_CH1_SCL (out), I2C_CH1_SDA (bidir), I2C_CH2_SCL (out), I2C_CH2_SDA (bidir), I2C_CH3_SCL (out), I2C_CH3_SDA (bidir), I2C_CH4_SCL (out), I2C_CH4_SDA (bidir), I2C_CH5_SCL (out), I2C_CH5_SDA (bidir), I2C_CH6_SCL (out), I2C_CH6_SDA (bidir), I2C_CH7_SCL (out), I2C_CH7_SDA (bidir), I2C_SCL (in), I2C_SDA (bidir)

### Nets
3V3: C21.2 R32.2 R33.2 R34.2 U6.24(VCC)
GND: C21.1 C22.1 R35.1 R36.1 R37.1 U6.12(GND)
I2C_CH0_SCL: U6.5(SCL0) ; port I2C_CH0_SCL
I2C_CH0_SDA: U6.4(SDA0) ; port I2C_CH0_SDA
I2C_CH1_SCL: U6.7(SCL1) ; port I2C_CH1_SCL
I2C_CH1_SDA: U6.6(SDA1) ; port I2C_CH1_SDA
I2C_CH2_SCL: U6.9(SCL2) ; port I2C_CH2_SCL
I2C_CH2_SDA: U6.8(SDA2) ; port I2C_CH2_SDA
I2C_CH3_SCL: U6.11(SCL3) ; port I2C_CH3_SCL
I2C_CH3_SDA: U6.10(SDA3) ; port I2C_CH3_SDA
I2C_CH4_SCL: U6.14(SCL4) ; port I2C_CH4_SCL
I2C_CH4_SDA: U6.13(SDA4) ; port I2C_CH4_SDA
I2C_CH5_SCL: U6.16(SCL5) ; port I2C_CH5_SCL
I2C_CH5_SDA: U6.15(SDA5) ; port I2C_CH5_SDA
I2C_CH6_SCL: U6.18(SCL6) ; port I2C_CH6_SCL
I2C_CH6_SDA: U6.17(SDA6) ; port I2C_CH6_SDA
I2C_CH7_SCL: U6.20(SCL7) ; port I2C_CH7_SCL
I2C_CH7_SDA: U6.19(SDA7) ; port I2C_CH7_SDA
I2C_MUX_A0: R35.2 U6.1(A0)
I2C_MUX_A1: R36.2 U6.2(A1)
I2C_MUX_A2: R37.2 U6.21(A2)
I2C_SCL: R32.1 U6.22(SCL) ; port I2C_SCL
I2C_SDA: R33.1 U6.23(SDA) ; port I2C_SDA
~{I2C_MUX_RESET}: C22.2 R34.1 U6.3(~{RESET})

### Layout directives
net class I2C_Communication: I2C_CH0_SCL, I2C_CH0_SDA, I2C_CH1_SCL, I2C_CH1_SDA, I2C_CH2_SCL, I2C_CH2_SDA, I2C_CH3_SCL, I2C_CH3_SDA, I2C_CH4_SCL, I2C_CH4_SDA, I2C_CH5_SCL, I2C_CH5_SDA, I2C_CH6_SCL, I2C_CH6_SDA, I2C_CH7_SCL, I2C_CH7_SDA, I2C_SCL, I2C_SDA

### Notes on the sheet
- 20 mA
- © 2021 All rights reserved.
  This document may not, in whole or in part, be copied, photocopied, reproduced, translated or converted to any electronic or machine readable from without prior written permission of Mehmet Günce Akkoyun.
  Engineer contact : akkoyun@me.com
- Property of
- Engineer :
- Date :
- Size :
- A4
- Time :
- Project :
- Page :
- /
- Customer :
- Product ID :
- Module ID :
- Version :
- File :
- Revision :
- (in symbol IC - TCA9548) CH0; IN; CH1; CH2; CH3; CH4; CH5; CH6; Adr.; CH7

### Library data of the parts
C21 C22 = Capacitor - 100nF [0402-6V3]: as C5 on sheet RS485 Channel 1; ComponentLink1Description: Mouser; ComponentLink1URL: https://www.mouser.com.tr/ProductDetail/AVX/04026D104KAT4A?qs=sGAEpiMZZMs0AnBnWHyRQPg4iYkCw7IMED%2F4kpqgf7w%3D; ComponentLink2Description: DataSheet; ComponentLink2URL: https://www.mouser.com.tr/datasheet/2/40/cx5r-776519.pdf
R32-R34 = Resistor - 10K [0402]: as R107 on sheet I2C Network; ComponentLink1Description: DataSheet; ComponentLink1URL: https://www.mouser.com.tr/datasheet/2/427/dcrcwe3-1762152.pdf; ComponentLink2Description: Mouser; ComponentLink2URL: https://www.mouser.com.tr/ProductDetail/Vishay-Dale/CRCW040210K0FKED?qs=sGAEpiMZZMu61qfTUdNhG2DpbjADlD3GcalbOv9utCY%3D
R35-R37 = Resistor - 47K [0402]: as R4 on sheet RS485 Channel 1; ComponentLink1Description: DataSheet; ComponentLink1URL: https://www.mouser.com.tr/datasheet/2/427/dcrcwe3-1762152.pdf; ComponentLink2Description: Mouser; ComponentLink2URL: https://www.mouser.com.tr/ProductDetail/Vishay-Dale/CRCW040247K0FKED?qs=sGAEpiMZZMu61qfTUdNhG2DpbjADlD3GL%252B3h1elTxqU%3D
U6 = IC - TCA9548: TEXAS INSTRUMENTS - TCA9548APWR - I2C SWITCH W/ RESET, 8-CH, TSSOP-24; Supply Current - Max: 80 uA; Channel: 8; Maximum Operating Temperature: + 85 C; Minimum Operating Temperature: - 40 C; Product Type: Switch ICs; Manufacturer Part Number: TCA9548APWR; Case: TSSOP-24

## Sheet I2C DP Sensor 1.SchDoc: Delta Pressure Sensor 1
size 292 x 193 mm; SheetNumber: 14; SheetTotal: 40
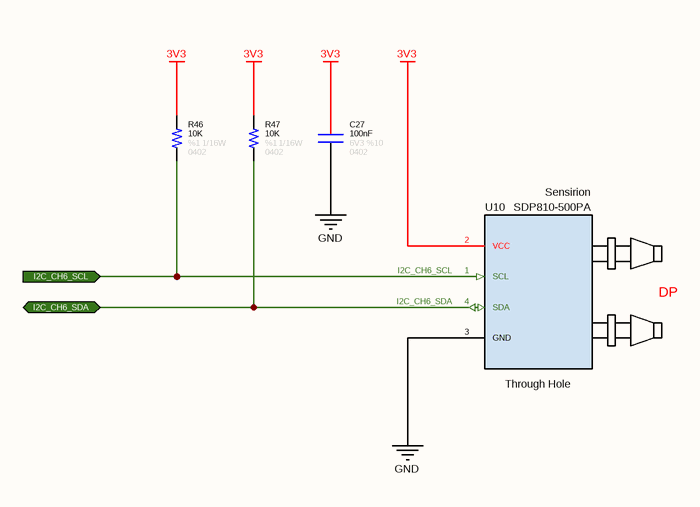
[diagram p9: I2C DP Sensor 1.SchDoc]

### Parts
C27  value 100nF  Tolerance: %10  Voltage: 6V3  Case: 0402  [CAPACITOR_0402]  (hidden comment: Capacitor - 100nF [0402] (Ceramic))
R46  value 10K  Tolerance: %1  Case: 0402  Power: 1/16W  [RESISTOR_0402]  (hidden comment: 10K - 0402 - %1 - 1/16W)
R47  value 10K  Tolerance: %1  Case: 0402  Power: 1/16W  [RESISTOR_0402]  (hidden comment: 10K - 0402 - %1 - 1/16W)
U10  Manufacturer Name: Sensirion  Case: Through Hole  [SDP810-500PA]  (hidden comment: SDP810-500PA)

### Ports
I2C_CH6_SCL (in), I2C_CH6_SDA (bidir)

### Nets
3V3: C27.2 R46.2 R47.2 U10.2(VCC)
GND: C27.1 U10.3(GND)
I2C_CH6_SCL: R46.1 U10.1(SCL) ; port I2C_CH6_SCL
I2C_CH6_SDA: R47.1 U10.4(SDA) ; port I2C_CH6_SDA

### Notes on the sheet
- © 2021 All rights reserved.
  This document may not, in whole or in part, be copied, photocopied, reproduced, translated or converted to any electronic or machine readable from without prior written permission of Mehmet Günce Akkoyun.
  Engineer contact : akkoyun@me.com
- Property of
- Engineer :
- Date :
- Size :
- A4
- Time :
- Project :
- Page :
- /
- Customer :
- Product ID :
- Module ID :
- Version :
- File :
- Revision :
- (in symbol IC - SDP810-500PA) DP

### Library data of the parts
C27 = Capacitor - 100nF [0402-6V3]: as C5 on sheet RS485 Channel 1; ComponentLink1Description: Mouser; ComponentLink1URL: https://www.mouser.com.tr/ProductDetail/AVX/04026D104KAT4A?qs=sGAEpiMZZMs0AnBnWHyRQPg4iYkCw7IMED%2F4kpqgf7w%3D; ComponentLink2Description: DataSheet; ComponentLink2URL: https://www.mouser.com.tr/datasheet/2/40/cx5r-776519.pdf
R46 R47 = Resistor - 10K [0402]: as R107 on sheet I2C Network; ComponentLink1Description: DataSheet; ComponentLink1URL: https://www.mouser.com.tr/datasheet/2/427/dcrcwe3-1762152.pdf; ComponentLink2Description: Mouser; ComponentLink2URL: https://www.mouser.com.tr/ProductDetail/Vishay-Dale/CRCW040210K0FKED?qs=sGAEpiMZZMu61qfTUdNhG2DpbjADlD3GcalbOv9utCY%3D
U10 = IC - SDP810-500PA: Board Mount Pressure Sensors Tube Connection, I2C , 500Pa; Operating Pressure: - 500 Pa to 500 Pa; Accuracy: 3 %; RoHS: Yes; Product Type: Differential Pressure Sensors; Manufacturer Part Number: SDP810-500PA

## Sheet I2C DP Sensor 2.SchDoc: Delta Pressure Sensor 2
size 292 x 193 mm; SheetNumber: 15; SheetTotal: 40
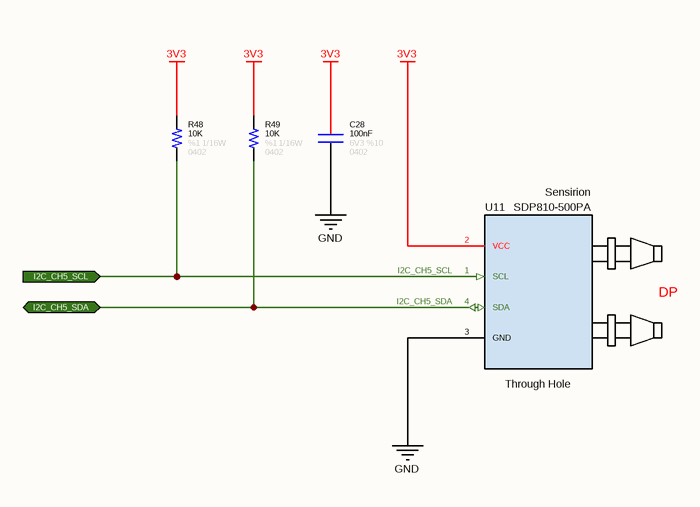
[diagram p10: I2C DP Sensor 2.SchDoc]

### Parts
C28  value 100nF  Tolerance: %10  Voltage: 6V3  Case: 0402  [CAPACITOR_0402]  (hidden comment: Capacitor - 100nF [0402] (Ceramic))
R48  value 10K  Tolerance: %1  Case: 0402  Power: 1/16W  [RESISTOR_0402]  (hidden comment: 10K - 0402 - %1 - 1/16W)
R49  value 10K  Tolerance: %1  Case: 0402  Power: 1/16W  [RESISTOR_0402]  (hidden comment: 10K - 0402 - %1 - 1/16W)
U11  Manufacturer Name: Sensirion  Case: Through Hole  [SDP810-500PA]  (hidden comment: SDP810-500PA)

### Ports
I2C_CH5_SCL (in), I2C_CH5_SDA (bidir)

### Nets
3V3: C28.2 R48.2 R49.2 U11.2(VCC)
GND: C28.1 U11.3(GND)
I2C_CH5_SCL: R48.1 U11.1(SCL) ; port I2C_CH5_SCL
I2C_CH5_SDA: R49.1 U11.4(SDA) ; port I2C_CH5_SDA

### Notes on the sheet
- © 2021 All rights reserved.
  This document may not, in whole or in part, be copied, photocopied, reproduced, translated or converted to any electronic or machine readable from without prior written permission of Mehmet Günce Akkoyun.
  Engineer contact : akkoyun@me.com
- Property of
- Engineer :
- Date :
- Size :
- A4
- Time :
- Project :
- Page :
- /
- Customer :
- Product ID :
- Module ID :
- Version :
- File :
- Revision :
- (in symbol IC - SDP810-500PA) DP

### Library data of the parts
C28 = Capacitor - 100nF [0402-6V3]: as C5 on sheet RS485 Channel 1; ComponentLink1Description: Mouser; ComponentLink1URL: https://www.mouser.com.tr/ProductDetail/AVX/04026D104KAT4A?qs=sGAEpiMZZMs0AnBnWHyRQPg4iYkCw7IMED%2F4kpqgf7w%3D; ComponentLink2Description: DataSheet; ComponentLink2URL: https://www.mouser.com.tr/datasheet/2/40/cx5r-776519.pdf
R48 R49 = Resistor - 10K [0402]: as R107 on sheet I2C Network; ComponentLink1Description: DataSheet; ComponentLink1URL: https://www.mouser.com.tr/datasheet/2/427/dcrcwe3-1762152.pdf; ComponentLink2Description: Mouser; ComponentLink2URL: https://www.mouser.com.tr/ProductDetail/Vishay-Dale/CRCW040210K0FKED?qs=sGAEpiMZZMu61qfTUdNhG2DpbjADlD3GcalbOv9utCY%3D
U11 = IC - SDP810-500PA: as U10 on sheet I2C DP Sensor 1; RoHS: Yes; Product Type: Differential Pressure Sensors; Manufacturer Part Number: SDP810-500PA

## Sheet I2C DP Sensor 3.SchDoc: Delta Pressure Sensor 3
size 292 x 193 mm; SheetNumber: 16; SheetTotal: 40
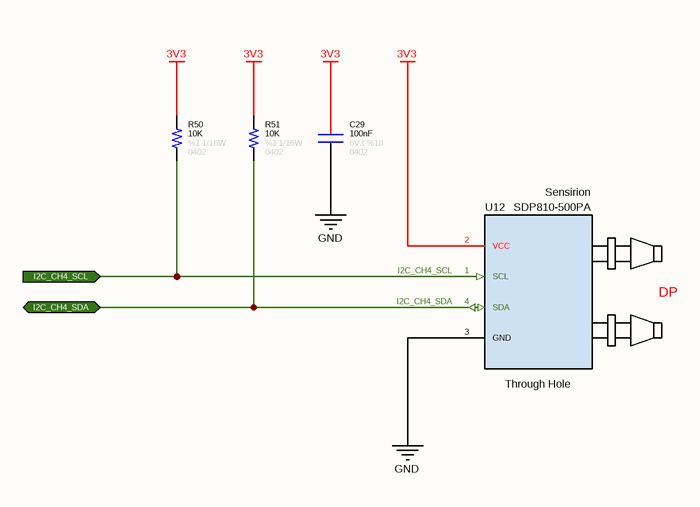
[diagram p11: I2C DP Sensor 3.SchDoc]

### Parts
C29  value 100nF  Tolerance: %10  Voltage: 6V3  Case: 0402  [CAPACITOR_0402]  (hidden comment: Capacitor - 100nF [0402] (Ceramic))
R50  value 10K  Tolerance: %1  Case: 0402  Power: 1/16W  [RESISTOR_0402]  (hidden comment: 10K - 0402 - %1 - 1/16W)
R51  value 10K  Tolerance: %1  Case: 0402  Power: 1/16W  [RESISTOR_0402]  (hidden comment: 10K - 0402 - %1 - 1/16W)
U12  Manufacturer Name: Sensirion  Case: Through Hole  [SDP810-500PA]  (hidden comment: SDP810-500PA)

### Ports
I2C_CH4_SCL (in), I2C_CH4_SDA (bidir)

### Nets
3V3: C29.2 R50.2 R51.2 U12.2(VCC)
GND: C29.1 U12.3(GND)
I2C_CH4_SCL: R50.1 U12.1(SCL) ; port I2C_CH4_SCL
I2C_CH4_SDA: R51.1 U12.4(SDA) ; port I2C_CH4_SDA

### Notes on the sheet
- © 2021 All rights reserved.
  This document may not, in whole or in part, be copied, photocopied, reproduced, translated or converted to any electronic or machine readable from without prior written permission of Mehmet Günce Akkoyun.
  Engineer contact : akkoyun@me.com
- Property of
- Engineer :
- Date :
- Size :
- A4
- Time :
- Project :
- Page :
- /
- Customer :
- Product ID :
- Module ID :
- Version :
- File :
- Revision :
- (in symbol IC - SDP810-500PA) DP

### Library data of the parts
C29 = Capacitor - 100nF [0402-6V3]: as C5 on sheet RS485 Channel 1; ComponentLink1Description: Mouser; ComponentLink1URL: https://www.mouser.com.tr/ProductDetail/AVX/04026D104KAT4A?qs=sGAEpiMZZMs0AnBnWHyRQPg4iYkCw7IMED%2F4kpqgf7w%3D; ComponentLink2Description: DataSheet; ComponentLink2URL: https://www.mouser.com.tr/datasheet/2/40/cx5r-776519.pdf
R50 R51 = Resistor - 10K [0402]: as R107 on sheet I2C Network; ComponentLink1Description: DataSheet; ComponentLink1URL: https://www.mouser.com.tr/datasheet/2/427/dcrcwe3-1762152.pdf; ComponentLink2Description: Mouser; ComponentLink2URL: https://www.mouser.com.tr/ProductDetail/Vishay-Dale/CRCW040210K0FKED?qs=sGAEpiMZZMu61qfTUdNhG2DpbjADlD3GcalbOv9utCY%3D
U12 = IC - SDP810-500PA: as U10 on sheet I2C DP Sensor 1; RoHS: Yes; Product Type: Differential Pressure Sensors; Manufacturer Part Number: SDP810-500PA